# EAGLE schematic data-board (EAGLE 5.07)

## Sheet 1 of 13
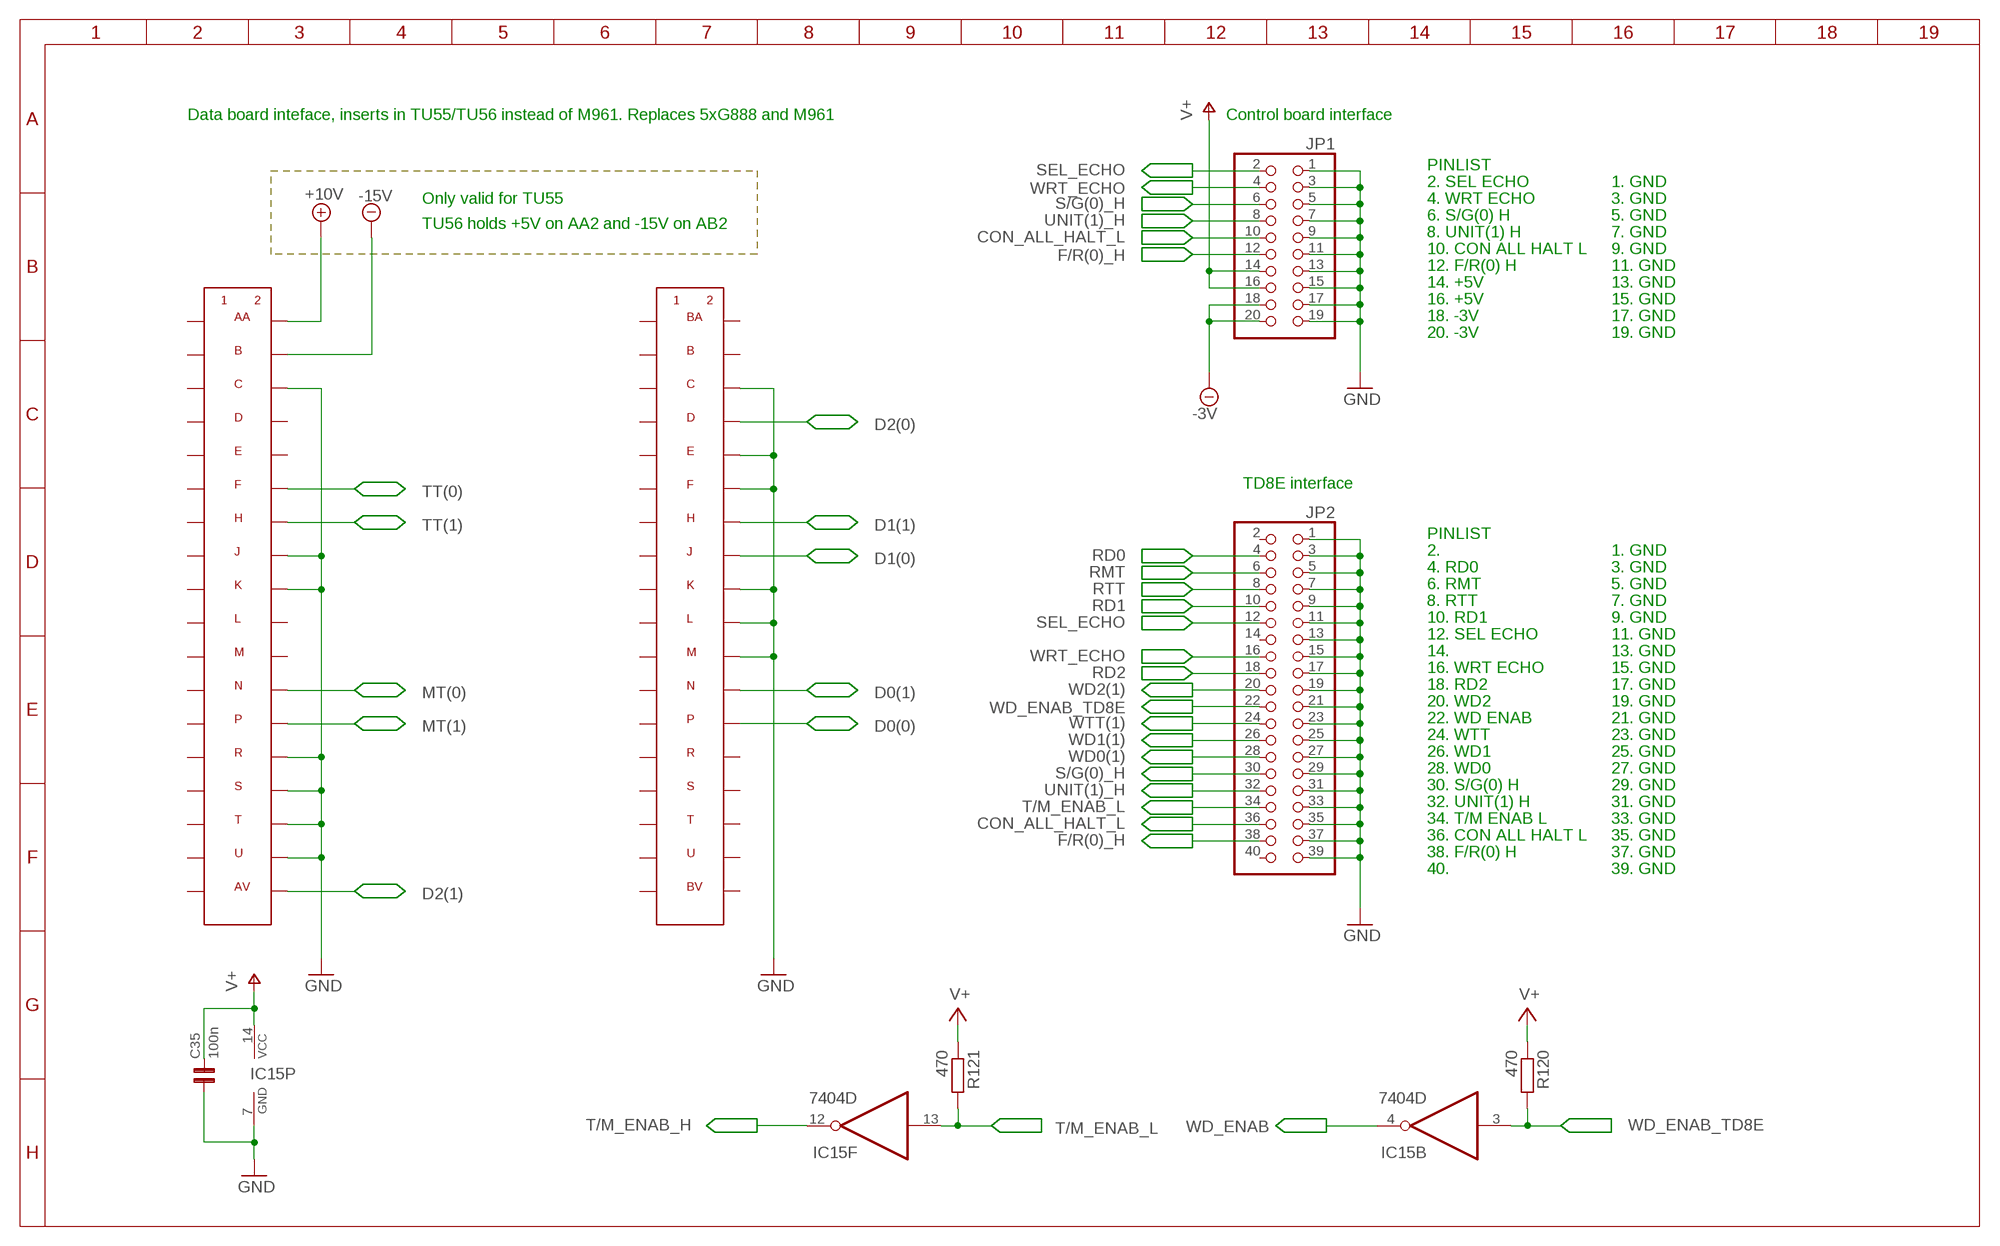
[diagram p0: schematic, sheet 1]

### Parts
C35  100n  C0805  [0805]
IC15  7404D  [SO14]
J1  FLIPCHIP_2  FLIPCHIP_2-SBS  [FLIPCHIP-21]
JP1  PINHD-2X10/90-FRAMED  [2Z10/90-FRAMED]
JP2  PINHD-2X20/90-FRAMED  [2X20/90-FRAMED]
R120  470  R-EU_R0805  [R0805]
R121  470  R-EU_R0805  [R0805]

### Nets
+10V: J1.AA2 ; also sheet 12
-3V: JP1.18 JP1.20 ; also sheet 12
-15V: J1.AB2 ; also sheet 12
CON_ALL_HALT_L: JP1.10 JP2.36
D0(0): J1.BP2 ; also sheet 4,9
D0(1): J1.BN2 ; also sheet 4,9
D1(0): J1.BJ2 ; also sheet 5,10
D1(1): J1.BH2 ; also sheet 5,10
D2(0): J1.BD2 ; also sheet 6,11
D2(1): J1.AV2 ; also sheet 6,11
F/R(0)_H: JP1.12 JP2.38
GND: C35.1 IC15.7(P:GND) J1.AC2 J1.AJ2 J1.AK2 J1.AR2 J1.AS2 J1.AT2 J1.AU2 J1.BC2 J1.BE2 J1.BF2 J1.BK2 J1.BL2 J1.BM2 JP1.1 JP1.3 JP1.5 JP1.7 JP1.9 JP1.11 JP1.13 JP1.15 JP1.17 JP1.19 JP2.1 JP2.3 JP2.5 JP2.7 JP2.9 JP2.11 JP2.13 JP2.15 JP2.17 JP2.19 JP2.21 JP2.23 JP2.25 JP2.27 JP2.29 JP2.31 JP2.33 JP2.35 JP2.37 JP2.39 ; also sheet 2,3,4,5,6,7,8,9,10,11,12
MT(0): J1.AN2 ; also sheet 3,8
MT(1): J1.AP2 ; also sheet 3,8
RD0: JP2.4 ; also sheet 4
RD1: JP2.10 ; also sheet 5
RD2: JP2.18 ; also sheet 6
RMT: JP2.6 ; also sheet 3
RTT: JP2.8 ; also sheet 2
S/G(0)_H: JP1.6 JP2.30
SEL_ECHO: JP1.2 JP2.12
T/M_ENAB_H: IC15.12(F:O) ; also sheet 7,8
T/M_ENAB_L: IC15.13(F:I) JP2.34 R121.2
TT(0): J1.AF2 ; also sheet 2,7
TT(1): J1.AH2 ; also sheet 2,7
UNIT(1)_H: JP1.8 JP2.32
V+: C35.2 IC15.14(P:VCC) JP1.14 JP1.16 R120.1 R121.1 ; also sheet 2,3,4,5,6,7,8,9,10,11,12
WD0(1): JP2.28 ; also sheet 8,9
WD1(1): JP2.26 ; also sheet 10
WD2(1): JP2.20 ; also sheet 11
WD_ENAB: IC15.4(B:O) ; also sheet 9,10,11
WD_ENAB_TD8E: IC15.3(B:I) JP2.22 R120.2
WRT_ECHO: JP1.4 JP2.16
WTT(1): JP2.24 ; also sheet 7
Unconnected: J1.AA1 J1.AB1 J1.AC1 J1.AD1 J1.AD2 J1.AE1 J1.AE2 J1.AF1 J1.AH1 J1.AJ1 J1.AK1 J1.AL1 J1.AL2 J1.AM1 J1.AM2 J1.AN1 J1.AP1 J1.AR1 J1.AS1 J1.AT1 J1.AU1 J1.AV1 J1.BA1 J1.BA2 J1.BB1 J1.BB2 J1.BC1 J1.BD1 J1.BE1 J1.BF1 J1.BH1 J1.BJ1 J1.BK1 J1.BL1 J1.BM1 J1.BN1 J1.BP1 J1.BR1 J1.BR2 J1.BS1 J1.BS2 J1.BT1 J1.BT2 J1.BU1 J1.BU2 J1.BV1 J1.BV2 JP2.2 JP2.14 JP2.40

### Notes on the sheet
- Data board inteface, inserts in TU55/TU56 instead of M961. Replaces 5xG888 and M961 | Control board interface
- PINLIST
- 2. SEL ECHO | 1. GND
- Only valid for TU55 | 4. WRT ECHO | 3. GND
- 6. S/G(0) H | 5. GND
- TU56 holds +5V on AA2 and -15V on AB2
- 8. UNIT(1) H | 7. GND
- 10. CON ALL HALT L | 9. GND
- 12. F/R(0) H | 11. GND
- 14. +5V | 13. GND
- 16. +5V | 15. GND
- 18. -3V | 17. GND
- 20. -3V | 19. GND
- TD8E interface
- PINLIST
- 2. | 1. GND
- 4. RD0 | 3. GND
- 6. RMT | 5. GND
- 8. RTT | 7. GND
- 10. RD1 | 9. GND
- 12. SEL ECHO | 11. GND
- 14. | 13. GND
- 16. WRT ECHO | 15. GND
- 18. RD2 | 17. GND
- 20. WD2 | 19. GND
- 22. WD ENAB | 21. GND
- 24. WTT | 23. GND
- 26. WD1 | 25. GND
- 28. WD0 | 27. GND
- 30. S/G(0) H | 29. GND
- 32. UNIT(1) H | 31. GND
- 34. T/M ENAB L | 33. GND
- 36. CON ALL HALT L | 35. GND
- 38. F/R(0) H | 37. GND
- 40. | 39. GND

## Sheet 2 of 13
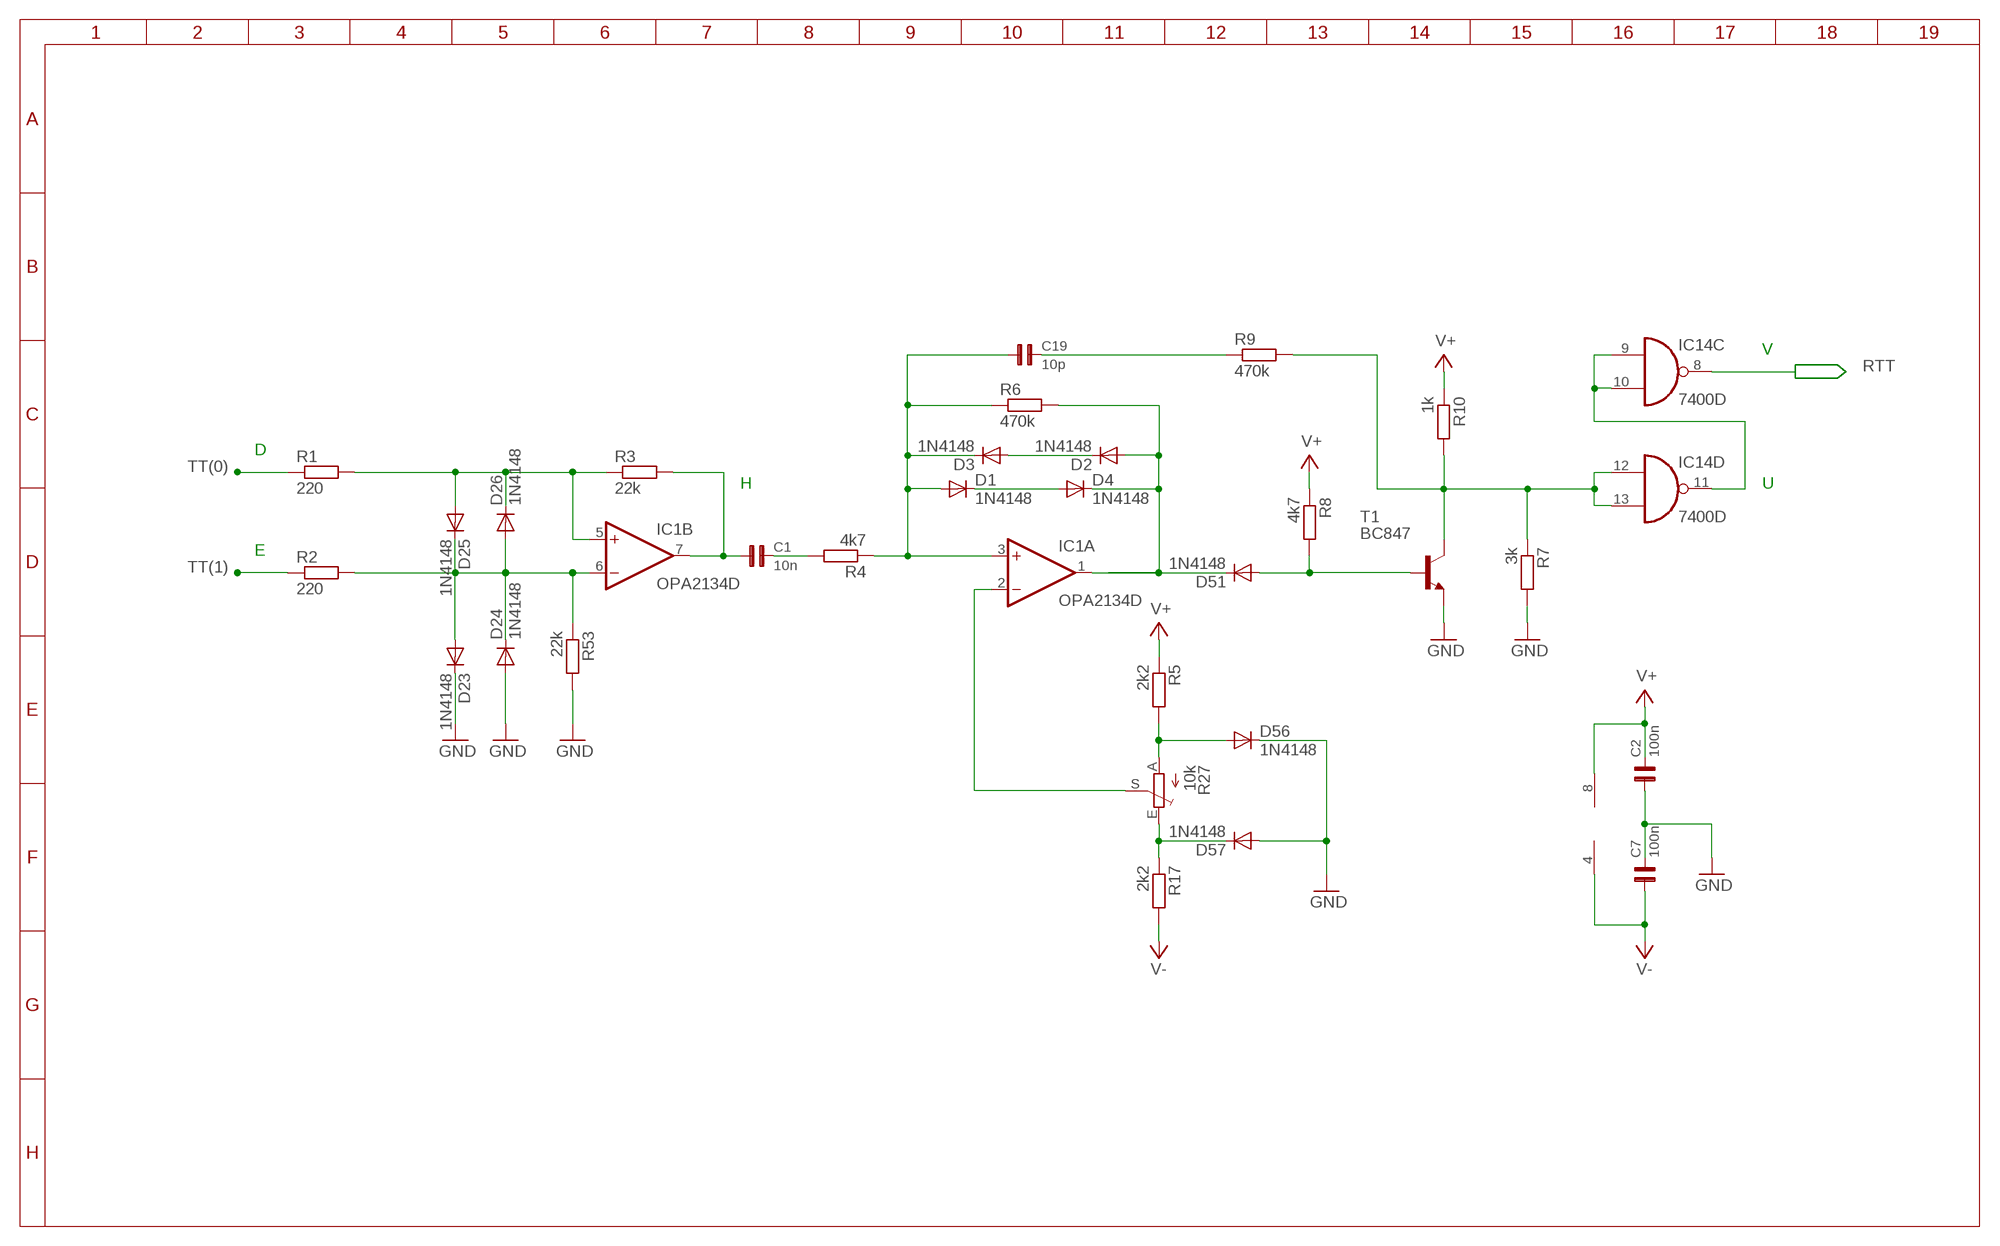
[diagram p1: schematic, sheet 2]

### Parts
C1  10n  C0805  [0805]
C2  100n  C0805  [0805]
C7  100n  C0805  [0805]
C19  10p  C0805  [0805]
D1  1N4148  1N4148-Y  [SOD123]
D2  1N4148  1N4148-Y  [SOD123]
D3  1N4148  1N4148-Y  [SOD123]
D4  1N4148  1N4148-Y  [SOD123]
D23  1N4148  1N4148-Y  [SOD123]
D24  1N4148  1N4148-Y  [SOD123]
D25  1N4148  1N4148-Y  [SOD123]
D26  1N4148  1N4148-Y  [SOD123]
D51  1N4148  1N4148-Y  [SOD123]
D56  1N4148  1N4148-Y  [SOD123]
D57  1N4148  1N4148-Y  [SOD123]
IC1  OPA2134D  [SOIC8]
IC14  7400D  [SO14]
R1  220  R-EU_R0805  [R0805]
R2  220  R-EU_R0805  [R0805]
R3  22k  R-EU_R0805  [R0805]
R4  4k7  R-EU_R0805  [R0805]
R5  2k2  R-EU_R0805  [R0805]
R6  470k  R-EU_R0805  [R0805]
R7  3k  R-EU_R0805  [R0805]
R8  4k7  R-EU_R0805  [R0805]
R9  470k  R-EU_R0805  [R0805]
R10  1k  R-EU_R0805  [R0805]
R17  2k2  R-EU_R0805  [R0805]
R27  10k  TRIM_EU-SP19L  [SP19L]
R53  22k  R-EU_R0805  [R0805]
T1  BC847  [SOT23]

### Nets
GND: C2.1 C7.2 D23.C D24.A D56.C D57.A R7.2 R53.2 T1.2(E) ; also sheet 1,3,4,5,6,7,8,9,10,11,12
N$1: D25.A D26.C IC1.5(B:+IN) R1.2 R3.1
N$3: C1.1 IC1.7(B:OUT) R3.2
N$4: D1.C D4.A
N$5: C19.1 D1.A D3.C IC1.3(A:+IN) R4.1 R6.1
N$7: D2.A D4.C D51.C IC1.1(A:OUT) R6.2
N$8: D51.A R8.2 T1.1(B)
N$9: C19.2 R9.1
N$11: D2.C D3.A
N$12: C1.2 R4.2
N$33: IC1.2(A:-IN) R27.S
N$47: D56.A R5.2 R27.A
N$73: D57.C R17.1 R27.E
N$116: IC14.9(C:I0) IC14.10(C:I1) IC14.11(D:O)
N$128: D23.A D24.C D25.C D26.A IC1.6(B:-IN) R2.2 R53.1
RTT: IC14.8(C:O) ; also sheet 1
TIMING: IC14.12(D:I0) IC14.13(D:I1) R7.1 R9.2 R10.2 T1.3(C)
TT(0): R1.1 ; also sheet 1,7
TT(1): R2.1 ; also sheet 1,7
V+: C2.2 IC1.8(P:V+) R5.1 R8.1 R10.1 ; also sheet 1,3,4,5,6,7,8,9,10,11,12
V-: C7.1 IC1.4(P:V-) R17.2 ; also sheet 3,4,5,6,12

### Notes on the sheet
- V
- D
- H | U
- E

## Sheet 3 of 13
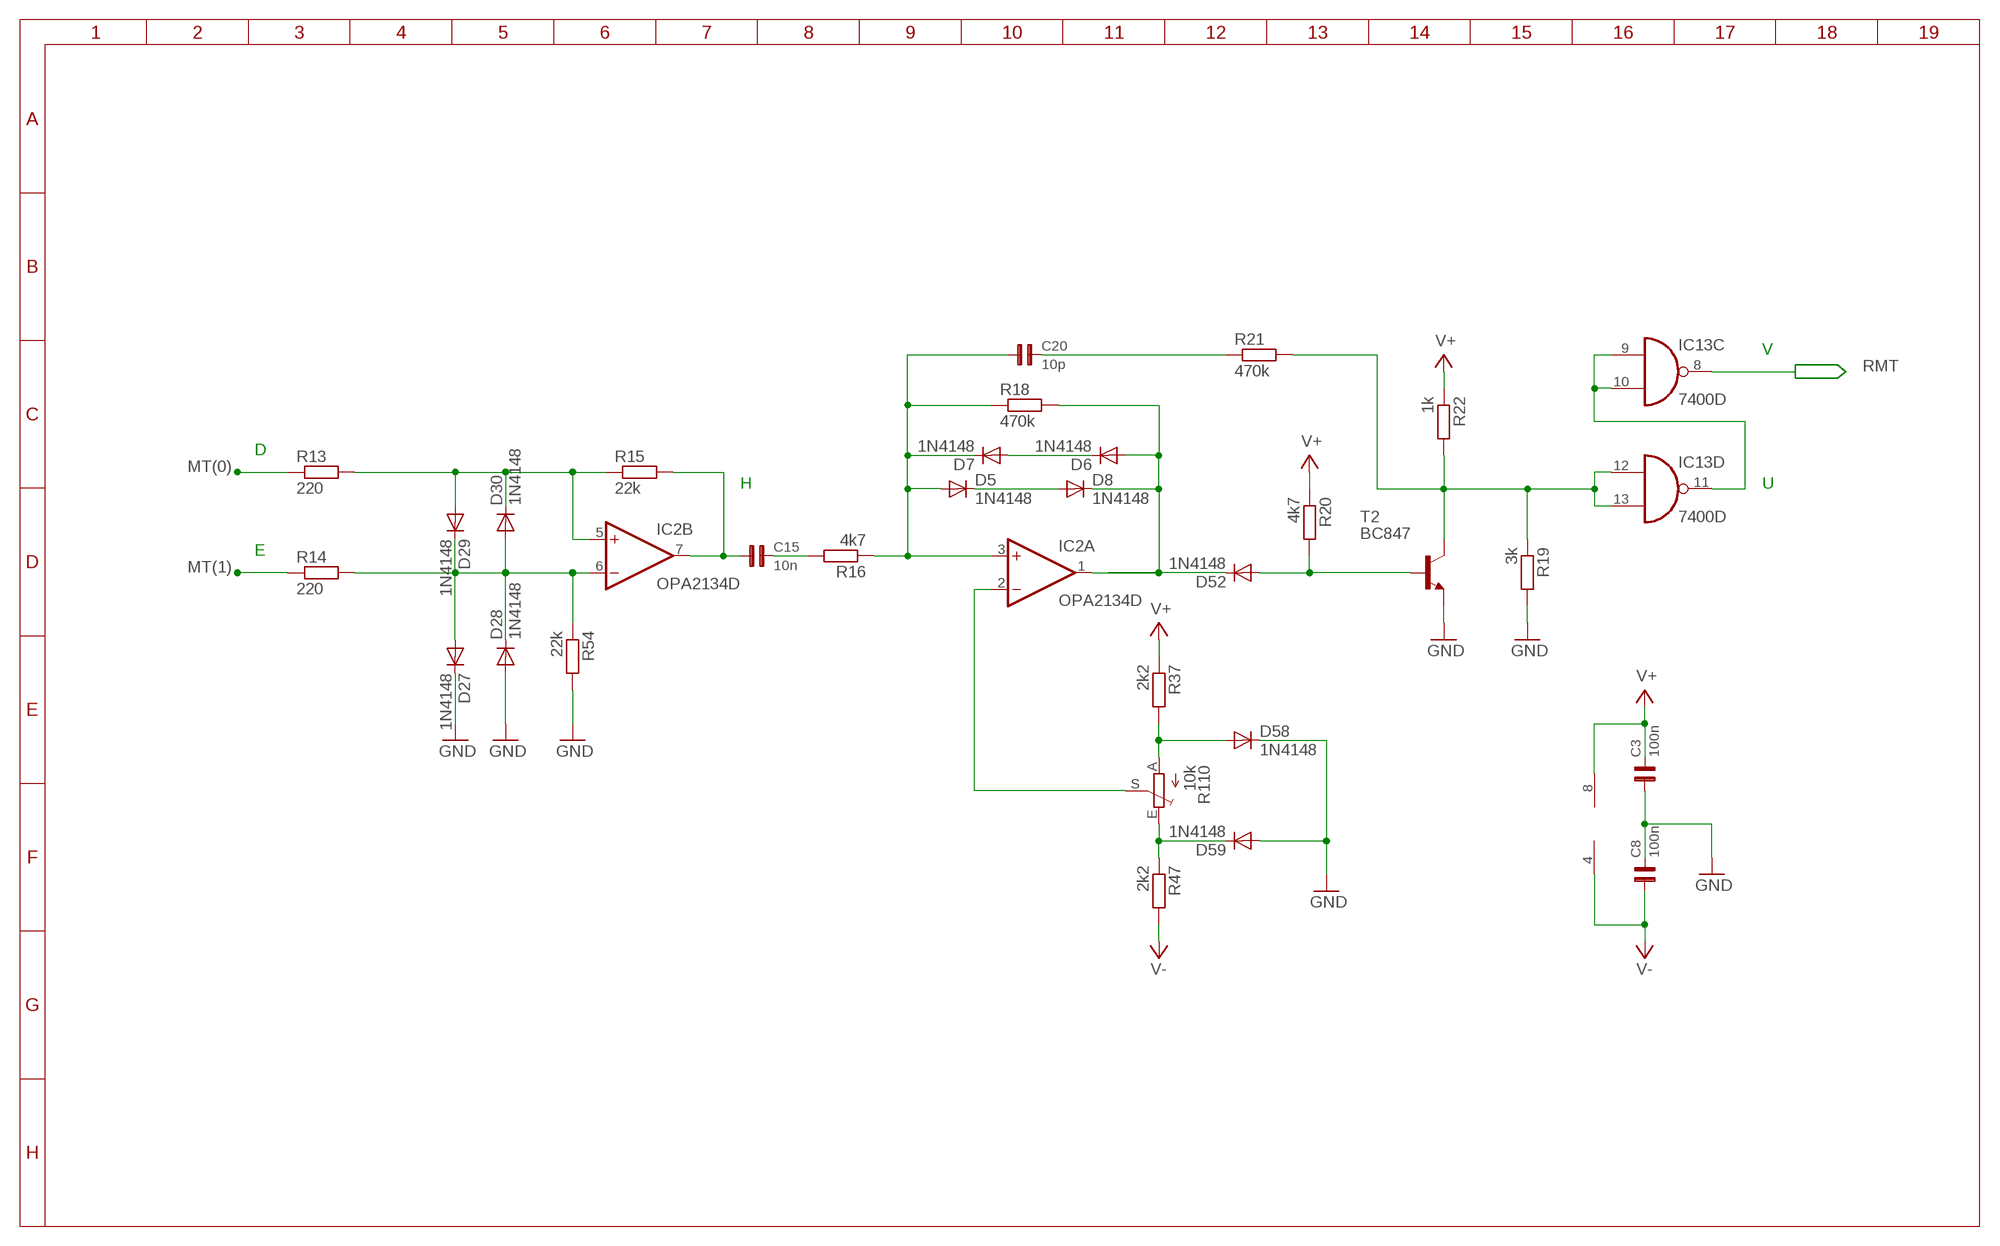
[diagram p2: schematic, sheet 3]

### Parts
C3  100n  C0805  [0805]
C8  100n  C0805  [0805]
C15  10n  C0805  [0805]
C20  10p  C0805  [0805]
D5  1N4148  1N4148-Y  [SOD123]
D6  1N4148  1N4148-Y  [SOD123]
D7  1N4148  1N4148-Y  [SOD123]
D8  1N4148  1N4148-Y  [SOD123]
D27  1N4148  1N4148-Y  [SOD123]
D28  1N4148  1N4148-Y  [SOD123]
D29  1N4148  1N4148-Y  [SOD123]
D30  1N4148  1N4148-Y  [SOD123]
D52  1N4148  1N4148-Y  [SOD123]
D58  1N4148  1N4148-Y  [SOD123]
D59  1N4148  1N4148-Y  [SOD123]
IC2  OPA2134D  [SOIC8]
IC13  7400D  [SO14]
R13  220  R-EU_R0805  [R0805]
R14  220  R-EU_R0805  [R0805]
R15  22k  R-EU_R0805  [R0805]
R16  4k7  R-EU_R0805  [R0805]
R18  470k  R-EU_R0805  [R0805]
R19  3k  R-EU_R0805  [R0805]
R20  4k7  R-EU_R0805  [R0805]
R21  470k  R-EU_R0805  [R0805]
R22  1k  R-EU_R0805  [R0805]
R37  2k2  R-EU_R0805  [R0805]
R47  2k2  R-EU_R0805  [R0805]
R54  22k  R-EU_R0805  [R0805]
R110  10k  TRIM_EU-SP19L  [SP19L]
T2  BC847  [SOT23]

### Nets
GND: C3.1 C8.2 D27.C D28.A D58.C D59.A R19.2 R54.2 T2.2(E) ; also sheet 1,2,4,5,6,7,8,9,10,11,12
MARK: IC13.12(D:I0) IC13.13(D:I1) R19.1 R21.2 R22.2 T2.3(C)
MT(0): R13.1 ; also sheet 1,8
MT(1): R14.1 ; also sheet 1,8
N$27: C15.1 IC2.7(B:OUT) R15.2
N$28: D5.C D8.A
N$29: C20.1 D5.A D7.C IC2.3(A:+IN) R16.1 R18.1
N$30: D6.A D8.C D52.C IC2.1(A:OUT) R18.2
N$32: D52.A R20.2 T2.1(B)
N$35: C15.2 R16.2
N$38: D6.C D7.A
N$76: IC13.9(C:I0) IC13.10(C:I1) IC13.11(D:O)
N$84: C20.2 R21.1
N$85: IC2.2(A:-IN) R110.S
N$86: D58.A R37.2 R110.A
N$87: D59.C R47.1 R110.E
N$129: D29.A D30.C IC2.5(B:+IN) R13.2 R15.1
N$130: D27.A D28.C D29.C D30.A IC2.6(B:-IN) R14.2 R54.1
RMT: IC13.8(C:O) ; also sheet 1
V+: C3.2 IC2.8(P:V+) R20.1 R22.1 R37.1 ; also sheet 1,2,4,5,6,7,8,9,10,11,12
V-: C8.1 IC2.4(P:V-) R47.2 ; also sheet 2,4,5,6,12

### Notes on the sheet
- V
- D
- H | U
- E

## Sheet 4 of 13
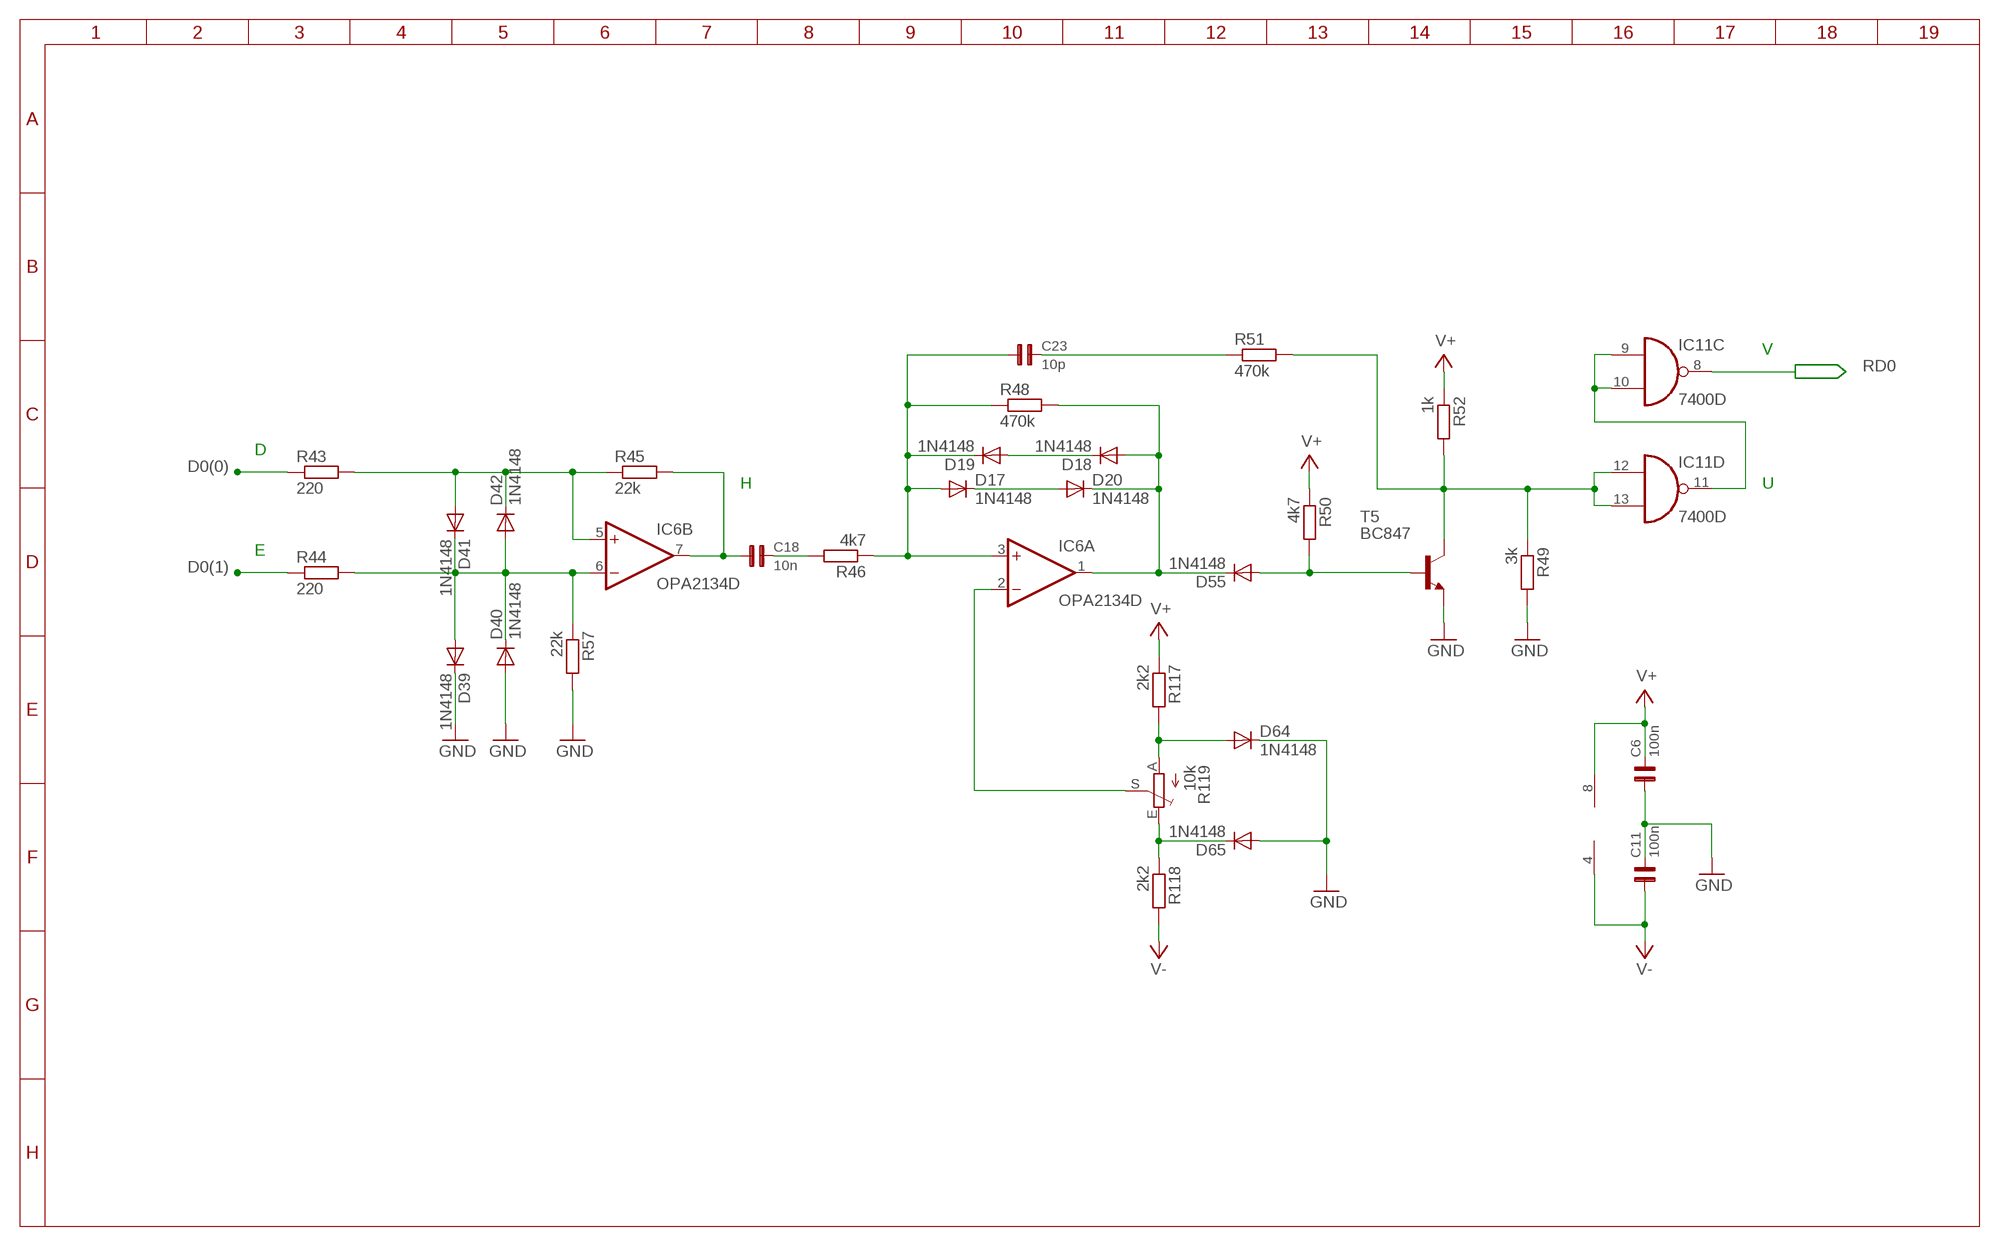
[diagram p3: schematic, sheet 4]

### Parts
C6  100n  C0805  [0805]
C11  100n  C0805  [0805]
C18  10n  C0805  [0805]
C23  10p  C0805  [0805]
D17  1N4148  1N4148-Y  [SOD123]
D18  1N4148  1N4148-Y  [SOD123]
D19  1N4148  1N4148-Y  [SOD123]
D20  1N4148  1N4148-Y  [SOD123]
D39  1N4148  1N4148-Y  [SOD123]
D40  1N4148  1N4148-Y  [SOD123]
D41  1N4148  1N4148-Y  [SOD123]
D42  1N4148  1N4148-Y  [SOD123]
D55  1N4148  1N4148-Y  [SOD123]
D64  1N4148  1N4148-Y  [SOD123]
D65  1N4148  1N4148-Y  [SOD123]
IC6  OPA2134D  [SOIC8]
IC11  7400D  [SO14]
R43  220  R-EU_R0805  [R0805]
R44  220  R-EU_R0805  [R0805]
R45  22k  R-EU_R0805  [R0805]
R46  4k7  R-EU_R0805  [R0805]
R48  470k  R-EU_R0805  [R0805]
R49  3k  R-EU_R0805  [R0805]
R50  4k7  R-EU_R0805  [R0805]
R51  470k  R-EU_R0805  [R0805]
R52  1k  R-EU_R0805  [R0805]
R57  22k  R-EU_R0805  [R0805]
R117  2k2  R-EU_R0805  [R0805]
R118  2k2  R-EU_R0805  [R0805]
R119  10k  TRIM_EU-SP19L  [SP19L]
T5  BC847  [SOT23]

### Nets
D0(0): R43.1 ; also sheet 1,9
D0(1): R44.1 ; also sheet 1,9
DATA1: IC11.12(D:I0) IC11.13(D:I1) R49.1 R51.2 R52.2 T5.3(C)
GND: C6.1 C11.2 D39.C D40.A D64.C D65.A R49.2 R57.2 T5.2(E) ; also sheet 1,2,3,5,6,7,8,9,10,11,12
N$10: C23.2 R51.1
N$49: IC11.9(C:I0) IC11.10(C:I1) IC11.11(D:O)
N$66: C18.1 IC6.7(B:OUT) R45.2
N$67: D17.C D20.A
N$68: C23.1 D17.A D19.C IC6.3(A:+IN) R46.1 R48.1
N$69: D18.A D20.C D55.C IC6.1(A:OUT) R48.2
N$71: D55.A R50.2 T5.1(B)
N$74: C18.2 R46.2
N$77: D18.C D19.A
N$92: D64.A R117.2 R119.A
N$93: D65.C R118.1 R119.E
N$115: IC6.2(A:-IN) R119.S
N$141: D41.A D42.C IC6.5(B:+IN) R43.2 R45.1
N$142: D39.A D40.C D41.C D42.A IC6.6(B:-IN) R44.2 R57.1
RD0: IC11.8(C:O) ; also sheet 1
V+: C6.2 IC6.8(P:V+) R50.1 R52.1 R117.1 ; also sheet 1,2,3,5,6,7,8,9,10,11,12
V-: C11.1 IC6.4(P:V-) R118.2 ; also sheet 2,3,5,6,12

### Notes on the sheet
- V
- D
- H | U
- E

## Sheet 5 of 13
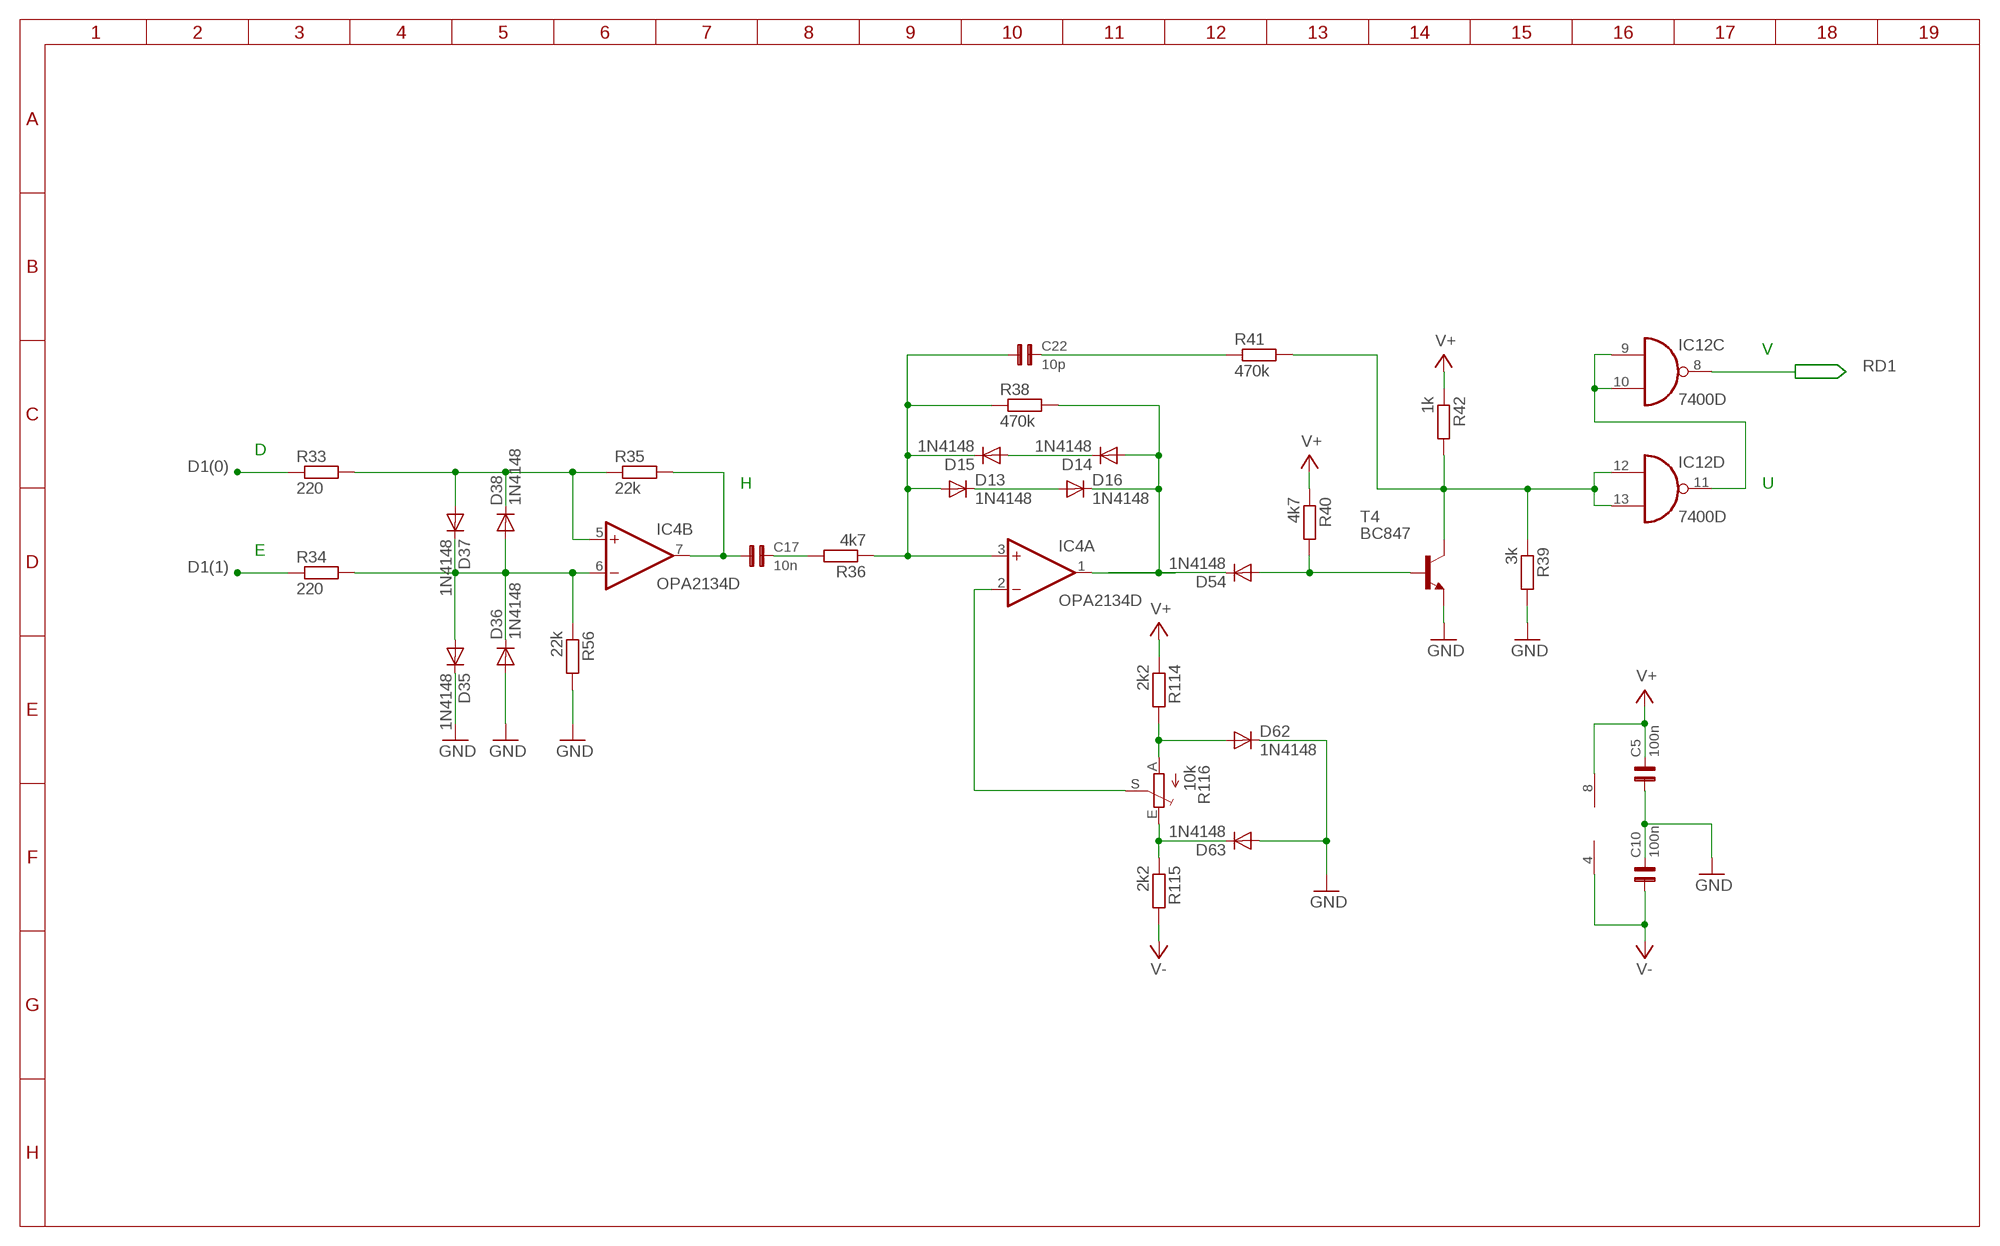
[diagram p4: schematic, sheet 5]

### Parts
C5  100n  C0805  [0805]
C10  100n  C0805  [0805]
C17  10n  C0805  [0805]
C22  10p  C0805  [0805]
D13  1N4148  1N4148-Y  [SOD123]
D14  1N4148  1N4148-Y  [SOD123]
D15  1N4148  1N4148-Y  [SOD123]
D16  1N4148  1N4148-Y  [SOD123]
D35  1N4148  1N4148-Y  [SOD123]
D36  1N4148  1N4148-Y  [SOD123]
D37  1N4148  1N4148-Y  [SOD123]
D38  1N4148  1N4148-Y  [SOD123]
D54  1N4148  1N4148-Y  [SOD123]
D62  1N4148  1N4148-Y  [SOD123]
D63  1N4148  1N4148-Y  [SOD123]
IC4  OPA2134D  [SOIC8]
IC12  7400D  [SO14]
R33  220  R-EU_R0805  [R0805]
R34  220  R-EU_R0805  [R0805]
R35  22k  R-EU_R0805  [R0805]
R36  4k7  R-EU_R0805  [R0805]
R38  470k  R-EU_R0805  [R0805]
R39  3k  R-EU_R0805  [R0805]
R40  4k7  R-EU_R0805  [R0805]
R41  470k  R-EU_R0805  [R0805]
R42  1k  R-EU_R0805  [R0805]
R56  22k  R-EU_R0805  [R0805]
R114  2k2  R-EU_R0805  [R0805]
R115  2k2  R-EU_R0805  [R0805]
R116  10k  TRIM_EU-SP19L  [SP19L]
T4  BC847  [SOT23]

### Nets
D1(0): R33.1 ; also sheet 1,10
D1(1): R34.1 ; also sheet 1,10
DATA2: IC12.12(D:I0) IC12.13(D:I1) R39.1 R41.2 R42.2 T4.3(C)
GND: C5.1 C10.2 D35.C D36.A D62.C D63.A R39.2 R56.2 T4.2(E) ; also sheet 1,2,3,4,6,7,8,9,10,11,12
N$34: C22.2 R41.1
N$53: C17.1 IC4.7(B:OUT) R35.2
N$54: D13.C D16.A
N$55: C22.1 D13.A D15.C IC4.3(A:+IN) R36.1 R38.1
N$56: D14.A D16.C D54.C IC4.1(A:OUT) R38.2
N$58: D54.A R40.2 T4.1(B)
N$61: C17.2 R36.2
N$64: D14.C D15.A
N$79: IC12.9(C:I0) IC12.10(C:I1) IC12.11(D:O)
N$90: D62.A R114.2 R116.A
N$91: D63.C R115.1 R116.E
N$98: IC4.2(A:-IN) R116.S
N$137: D37.A D38.C IC4.5(B:+IN) R33.2 R35.1
N$138: D35.A D36.C D37.C D38.A IC4.6(B:-IN) R34.2 R56.1
RD1: IC12.8(C:O) ; also sheet 1
V+: C5.2 IC4.8(P:V+) R40.1 R42.1 R114.1 ; also sheet 1,2,3,4,6,7,8,9,10,11,12
V-: C10.1 IC4.4(P:V-) R115.2 ; also sheet 2,3,4,6,12

### Notes on the sheet
- V
- D
- H | U
- E

## Sheet 6 of 13
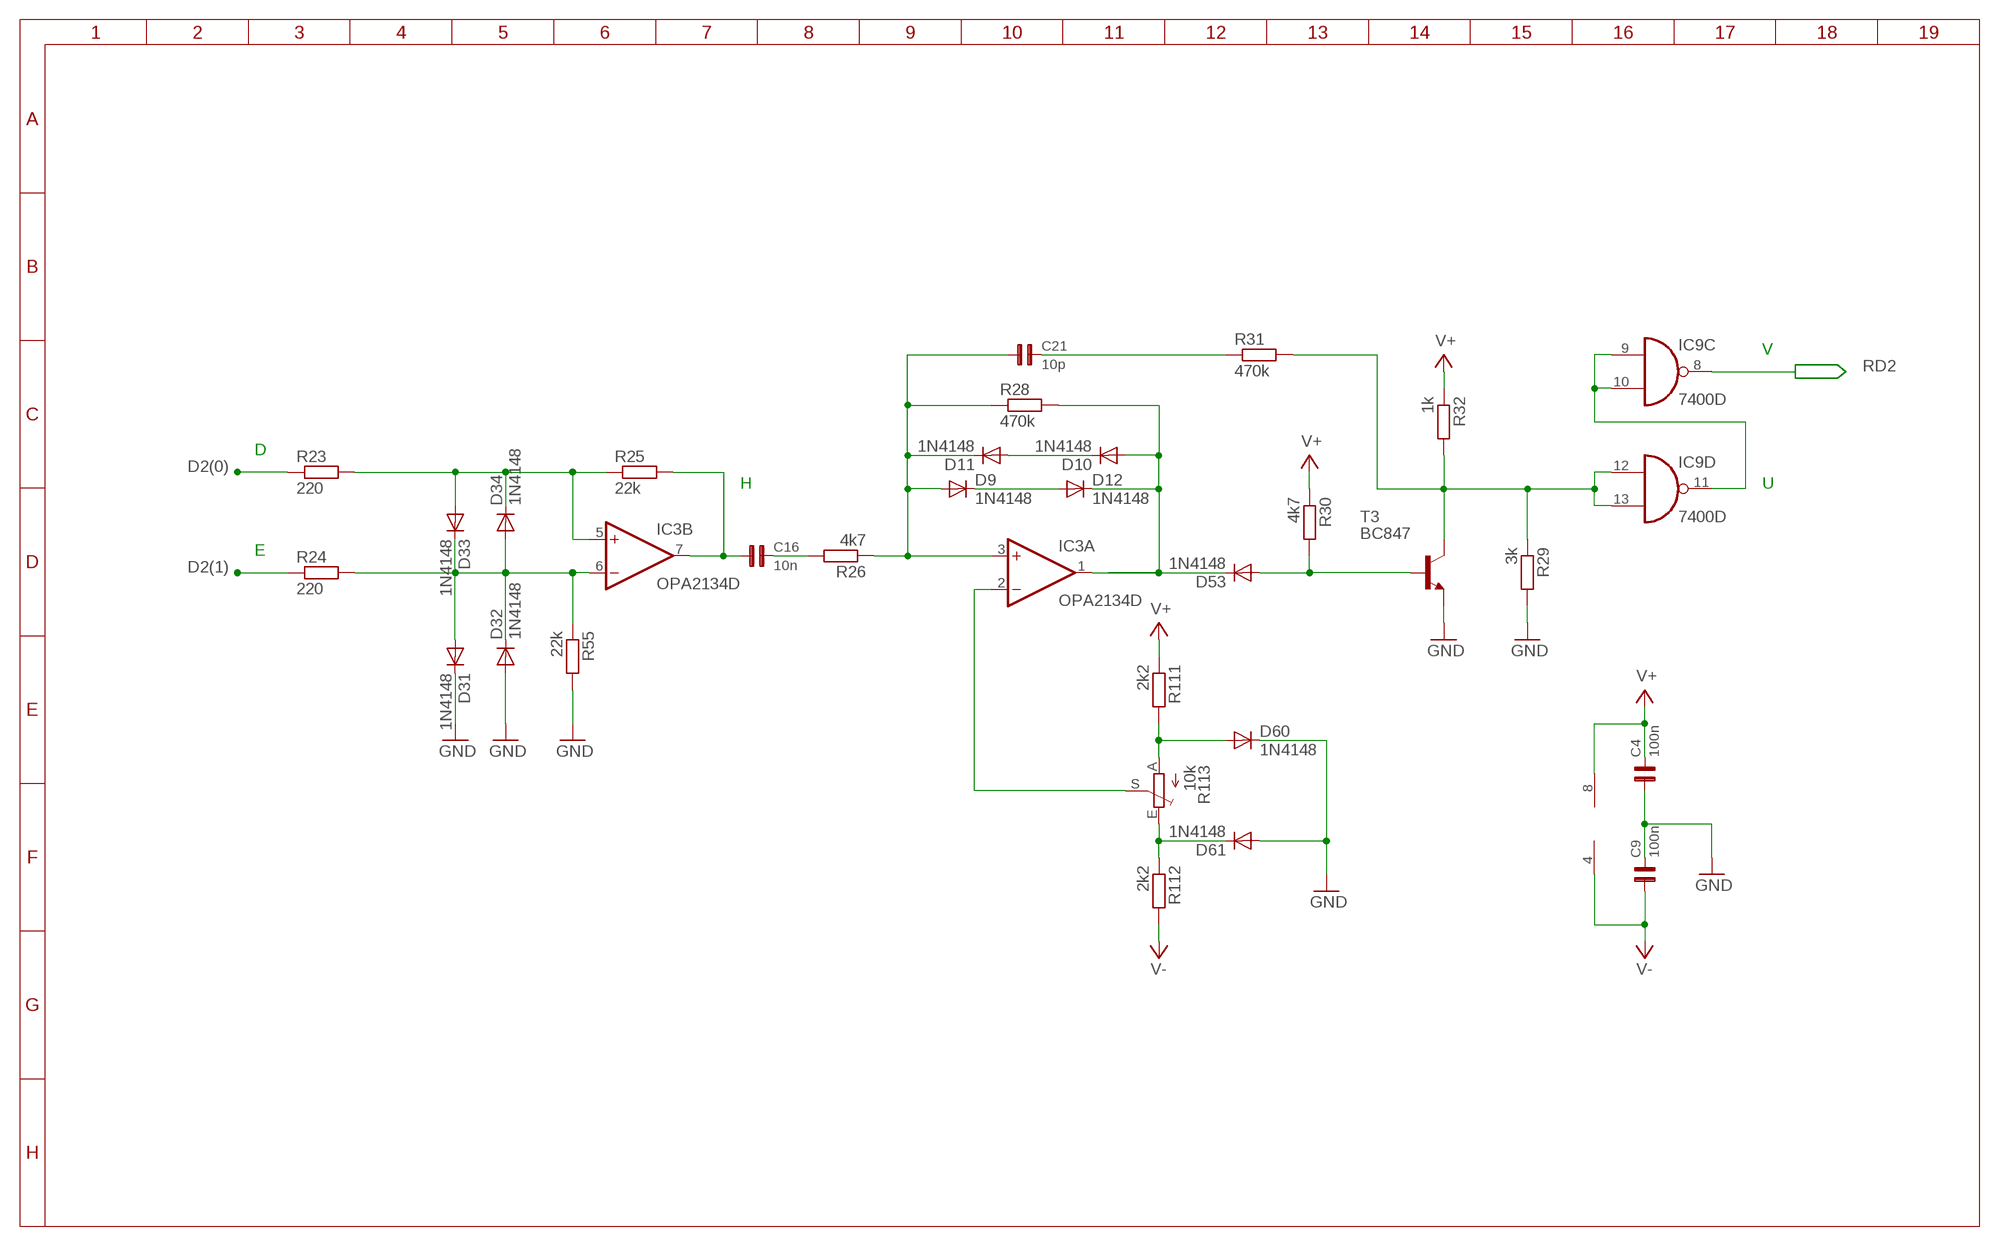
[diagram p5: schematic, sheet 6]

### Parts
C4  100n  C0805  [0805]
C9  100n  C0805  [0805]
C16  10n  C0805  [0805]
C21  10p  C0805  [0805]
D9  1N4148  1N4148-Y  [SOD123]
D10  1N4148  1N4148-Y  [SOD123]
D11  1N4148  1N4148-Y  [SOD123]
D12  1N4148  1N4148-Y  [SOD123]
D31  1N4148  1N4148-Y  [SOD123]
D32  1N4148  1N4148-Y  [SOD123]
D33  1N4148  1N4148-Y  [SOD123]
D34  1N4148  1N4148-Y  [SOD123]
D53  1N4148  1N4148-Y  [SOD123]
D60  1N4148  1N4148-Y  [SOD123]
D61  1N4148  1N4148-Y  [SOD123]
IC3  OPA2134D  [SOIC8]
IC9  7400D  [SO14]
R23  220  R-EU_R0805  [R0805]
R24  220  R-EU_R0805  [R0805]
R25  22k  R-EU_R0805  [R0805]
R26  4k7  R-EU_R0805  [R0805]
R28  470k  R-EU_R0805  [R0805]
R29  3k  R-EU_R0805  [R0805]
R30  4k7  R-EU_R0805  [R0805]
R31  470k  R-EU_R0805  [R0805]
R32  1k  R-EU_R0805  [R0805]
R55  22k  R-EU_R0805  [R0805]
R111  2k2  R-EU_R0805  [R0805]
R112  2k2  R-EU_R0805  [R0805]
R113  10k  TRIM_EU-SP19L  [SP19L]
T3  BC847  [SOT23]

### Nets
D2(0): R23.1 ; also sheet 1,11
D2(1): R24.1 ; also sheet 1,11
DATA3: IC9.12(D:I0) IC9.13(D:I1) R29.1 R31.2 R32.2 T3.3(C)
GND: C4.1 C9.2 D31.C D32.A D60.C D61.A R29.2 R55.2 T3.2(E) ; also sheet 1,2,3,4,5,7,8,9,10,11,12
N$40: C16.1 IC3.7(B:OUT) R25.2
N$41: D9.C D12.A
N$42: C21.1 D9.A D11.C IC3.3(A:+IN) R26.1 R28.1
N$43: D10.A D12.C D53.C IC3.1(A:OUT) R28.2
N$45: D53.A R30.2 T3.1(B)
N$48: C16.2 R26.2
N$50: IC9.9(C:I0) IC9.10(C:I1) IC9.11(D:O)
N$51: D10.C D11.A
N$60: C21.2 R31.1
N$88: D60.A R111.2 R113.A
N$89: D61.C R112.1 R113.E
N$106: IC3.2(A:-IN) R113.S
N$133: D33.A D34.C IC3.5(B:+IN) R23.2 R25.1
N$134: D31.A D32.C D33.C D34.A IC3.6(B:-IN) R24.2 R55.1
RD2: IC9.8(C:O) ; also sheet 1
V+: C4.2 IC3.8(P:V+) R30.1 R32.1 R111.1 ; also sheet 1,2,3,4,5,7,8,9,10,11,12
V-: C9.1 IC3.4(P:V-) R112.2 ; also sheet 2,3,4,5,12

### Notes on the sheet
- V
- D
- H | U
- E

## Sheet 7 of 13
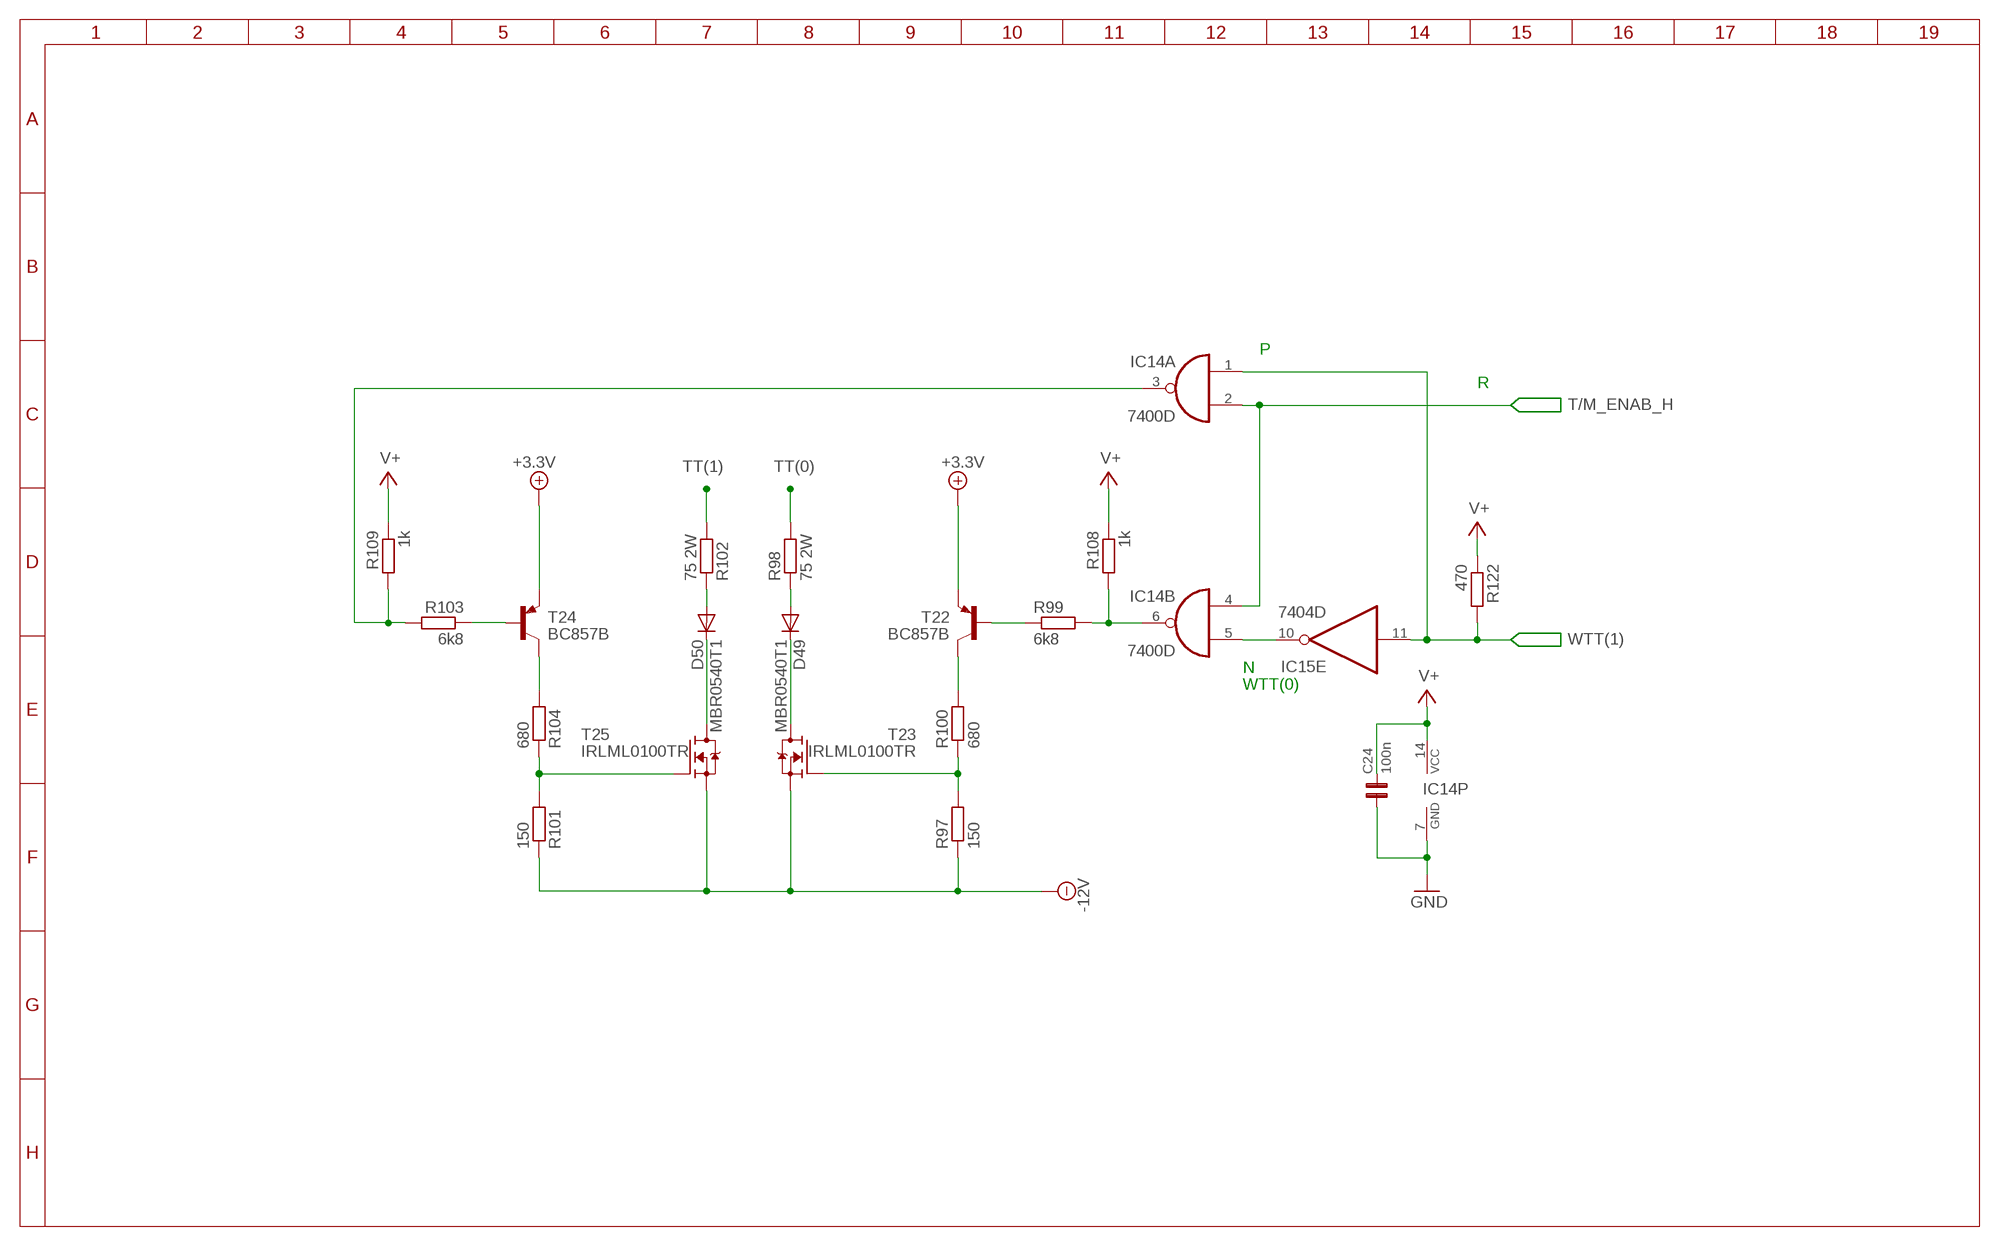
[diagram p6: schematic, sheet 7]

### Parts
C24  100n  C0805  [0805]
D49  MBR0540T1  [SOD123]
D50  MBR0540T1  [SOD123]
R97  150  R-EU_R0805  [R0805]
R98  75 2W  R-EU_R2512  [R2512]
R99  6k8  R-EU_R0805  [R0805]
R100  680  R-EU_R0805  [R0805]
R101  150  R-EU_R0805  [R0805]
R102  75 2W  R-EU_R2512  [R2512]
R103  6k8  R-EU_R0805  [R0805]
R104  680  R-EU_R0805  [R0805]
R108  1k  R-EU_R0805  [R0805]
R109  1k  R-EU_R0805  [R0805]
R122  470  R-EU_R0805  [R0805]
T22  BC857B  [SOT23]
T23  IRLML0100TR  [SOT23]
T24  BC857B  [SOT23]
T25  IRLML0100TR  [SOT23]

### Nets
+3.3V: T22.2(E) T24.2(E) ; also sheet 8,9,10,11,12
-12V: R97.1 R101.1 T23.2(S) T25.2(S) ; also sheet 8,9,10,11,12
GND: C24.1 IC14.7(P:GND) ; also sheet 1,2,3,4,5,6,8,9,10,11,12
N$62: IC14.5(B:I1) IC15.10(E:O)
N$81: IC14.6(B:O) R99.2 R108.2
N$83: IC14.3(A:O) R103.2 R109.2
N$131: R99.1 T22.1(B)
N$132: D49.A R98.1
N$135: D49.C T23.3(D)
N$136: R100.2 T22.3(C)
N$139: R97.2 R100.1 T23.1(G)
N$140: R103.1 T24.1(B)
N$143: D50.A R102.1
N$144: D50.C T25.3(D)
N$145: R104.2 T24.3(C)
N$146: R101.2 R104.1 T25.1(G)
T/M_ENAB_H: IC14.2(A:I1) IC14.4(B:I0) ; also sheet 1,8
TT(0): R98.2 ; also sheet 1,2
TT(1): R102.2 ; also sheet 1,2
V+: C24.2 IC14.14(P:VCC) R108.1 R109.1 R122.1 ; also sheet 1,2,3,4,5,6,8,9,10,11,12
WTT(1): IC14.1(A:I0) IC15.11(E:I) R122.2 ; also sheet 1

### Notes on the sheet
- P
- R
- N
- WTT(0)

## Sheet 8 of 13
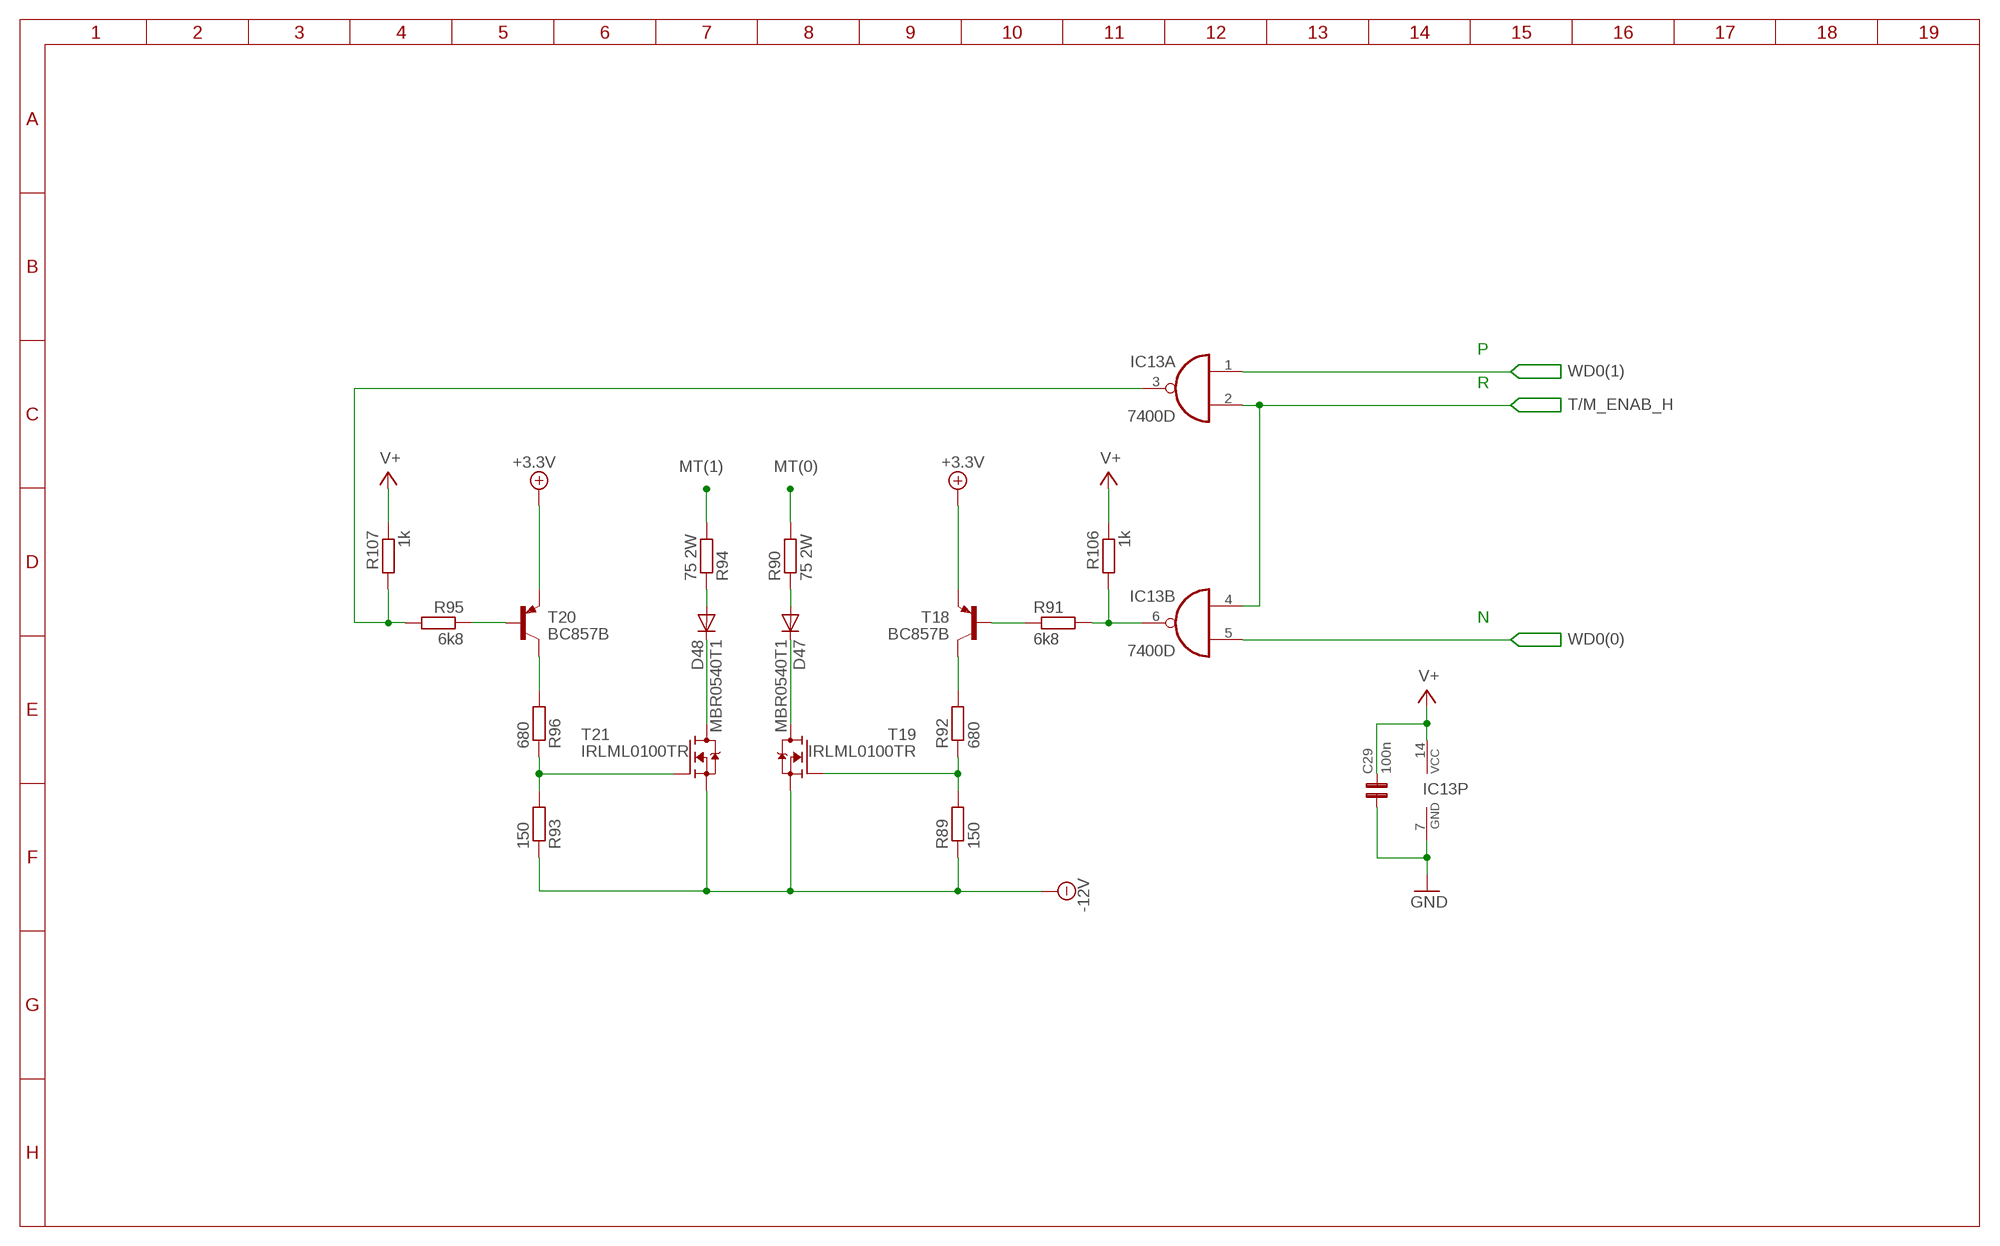
[diagram p7: schematic, sheet 8]

### Parts
C29  100n  C0805  [0805]
D47  MBR0540T1  [SOD123]
D48  MBR0540T1  [SOD123]
R89  150  R-EU_R0805  [R0805]
R90  75 2W  R-EU_R2512  [R2512]
R91  6k8  R-EU_R0805  [R0805]
R92  680  R-EU_R0805  [R0805]
R93  150  R-EU_R0805  [R0805]
R94  75 2W  R-EU_R2512  [R2512]
R95  6k8  R-EU_R0805  [R0805]
R96  680  R-EU_R0805  [R0805]
R106  1k  R-EU_R0805  [R0805]
R107  1k  R-EU_R0805  [R0805]
T18  BC857B  [SOT23]
T19  IRLML0100TR  [SOT23]
T20  BC857B  [SOT23]
T21  IRLML0100TR  [SOT23]

### Nets
+3.3V: T18.2(E) T20.2(E) ; also sheet 7,9,10,11,12
-12V: R89.1 R93.1 T19.2(S) T21.2(S) ; also sheet 7,9,10,11,12
GND: C29.1 IC13.7(P:GND) ; also sheet 1,2,3,4,5,6,7,9,10,11,12
MT(0): R90.2 ; also sheet 1,3
MT(1): R94.2 ; also sheet 1,3
N$78: IC13.6(B:O) R91.2 R106.2
N$80: IC13.3(A:O) R95.2 R107.2
N$104: R91.1 T18.1(B)
N$105: D47.A R90.1
N$107: D47.C T19.3(D)
N$108: R92.2 T18.3(C)
N$109: R89.2 R92.1 T19.1(G)
N$110: R95.1 T20.1(B)
N$111: D48.A R94.1
N$112: D48.C T21.3(D)
N$113: R96.2 T20.3(C)
N$114: R93.2 R96.1 T21.1(G)
T/M_ENAB_H: IC13.2(A:I1) IC13.4(B:I0) ; also sheet 1,7
V+: C29.2 IC13.14(P:VCC) R106.1 R107.1 ; also sheet 1,2,3,4,5,6,7,9,10,11,12
WD0(0): IC13.5(B:I1) ; also sheet 9
WD0(1): IC13.1(A:I0) ; also sheet 1,9

### Notes on the sheet
- P
- R
- N

## Sheet 9 of 13
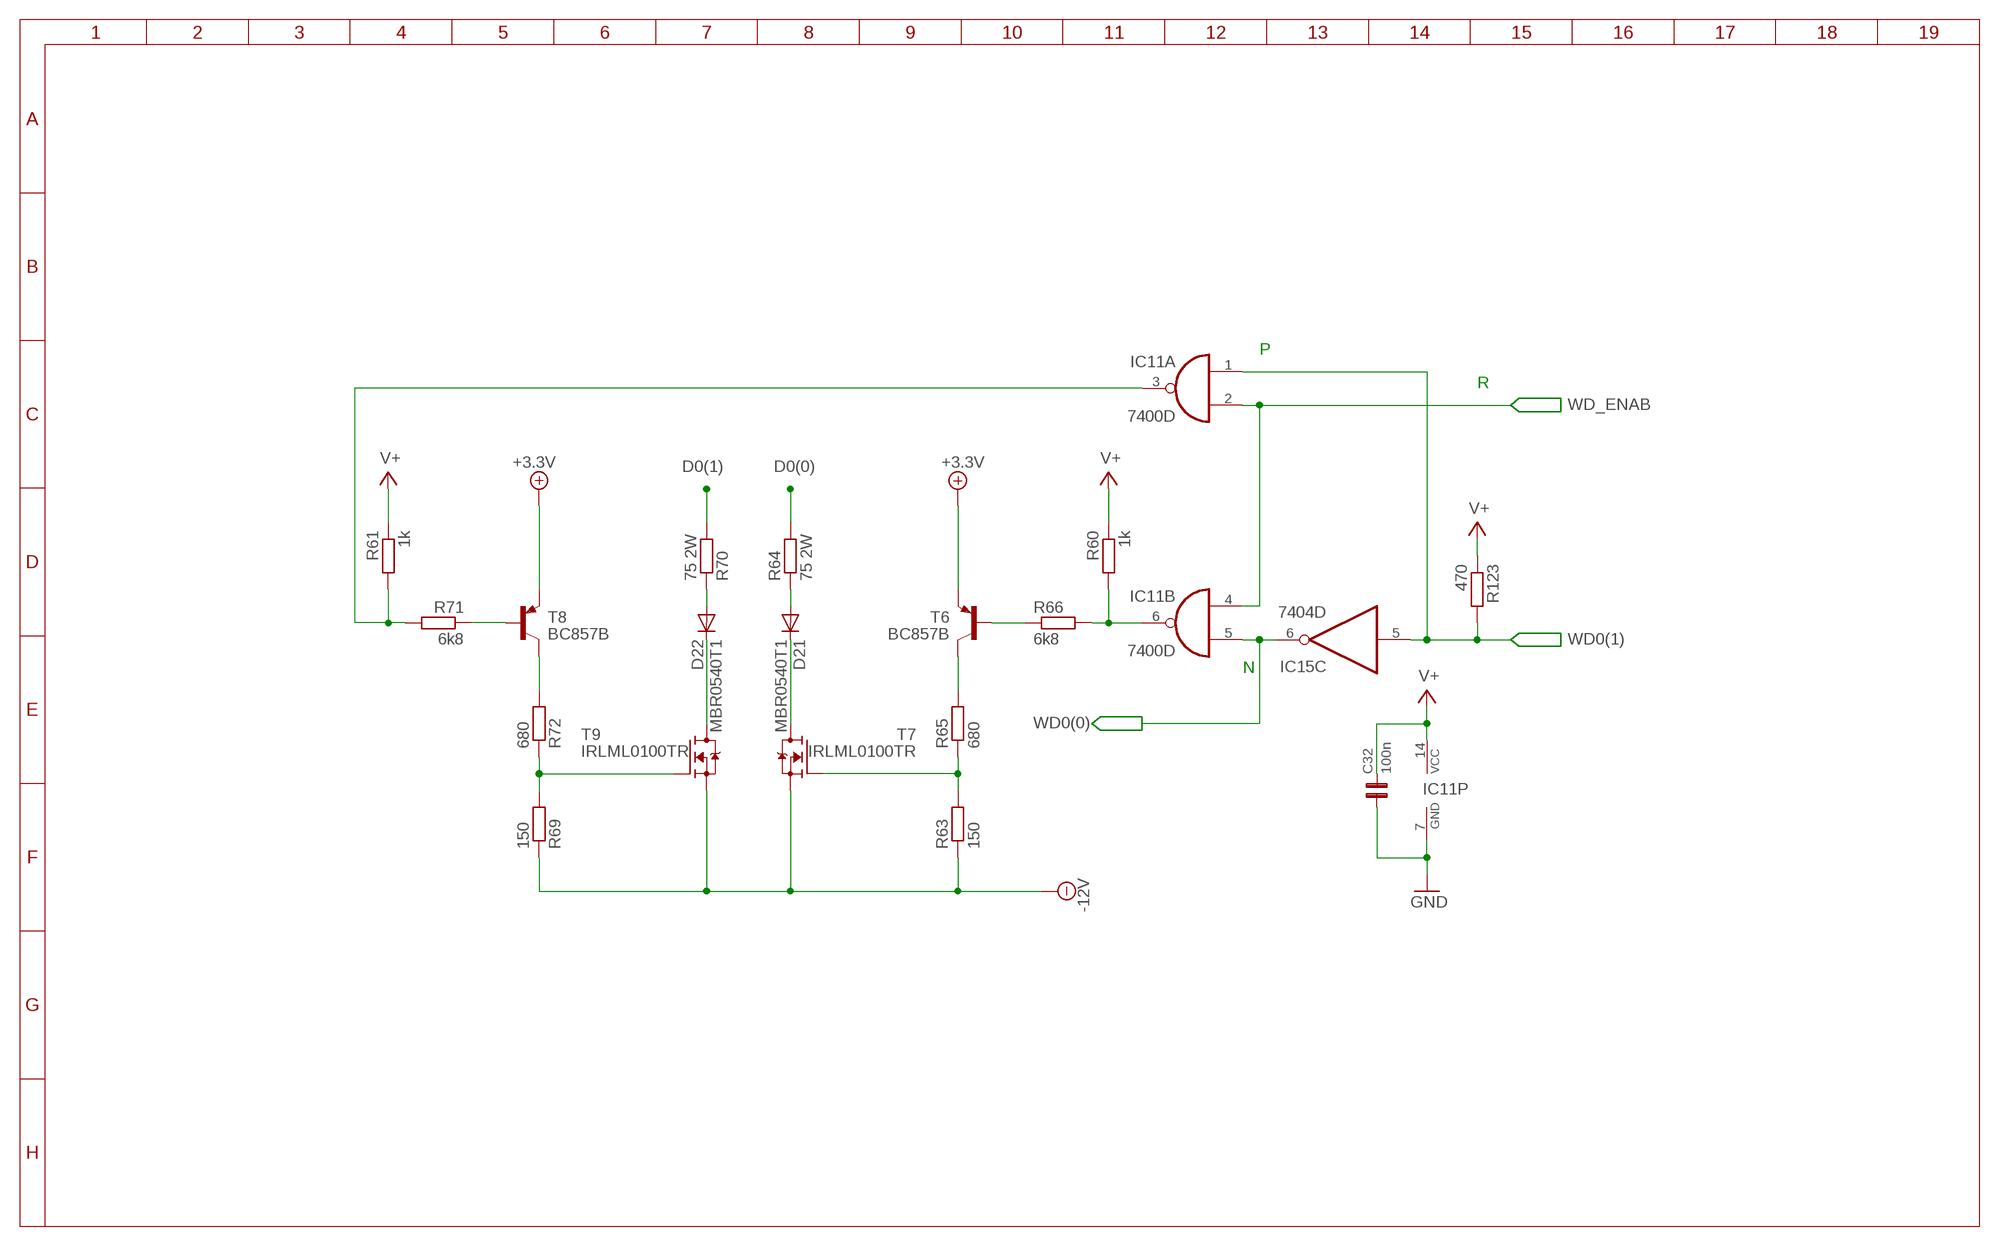
[diagram p8: schematic, sheet 9]

### Parts
C32  100n  C0805  [0805]
D21  MBR0540T1  [SOD123]
D22  MBR0540T1  [SOD123]
R60  1k  R-EU_R0805  [R0805]
R61  1k  R-EU_R0805  [R0805]
R63  150  R-EU_R0805  [R0805]
R64  75 2W  R-EU_R2512  [R2512]
R65  680  R-EU_R0805  [R0805]
R66  6k8  R-EU_R0805  [R0805]
R69  150  R-EU_R0805  [R0805]
R70  75 2W  R-EU_R2512  [R2512]
R71  6k8  R-EU_R0805  [R0805]
R72  680  R-EU_R0805  [R0805]
R123  470  R-EU_R0805  [R0805]
T6  BC857B  [SOT23]
T7  IRLML0100TR  [SOT23]
T8  BC857B  [SOT23]
T9  IRLML0100TR  [SOT23]

### Nets
+3.3V: T6.2(E) T8.2(E) ; also sheet 7,8,10,11,12
-12V: R63.1 R69.1 T7.2(S) T9.2(S) ; also sheet 7,8,10,11,12
D0(0): R64.2 ; also sheet 1,4
D0(1): R70.2 ; also sheet 1,4
GND: C32.1 IC11.7(P:GND) ; also sheet 1,2,3,4,5,6,7,8,10,11,12
N$63: IC11.6(B:O) R60.2 R66.2
N$94: R65.2 T6.3(C)
N$95: R63.2 R65.1 T7.1(G)
N$97: R71.1 T8.1(B)
N$99: R66.1 T6.1(B)
N$100: D22.A R70.1
N$102: D21.A R64.1
N$103: D21.C T7.3(D)
N$125: D22.C T9.3(D)
N$126: R72.2 T8.3(C)
N$127: R69.2 R72.1 T9.1(G)
V+: C32.2 IC11.14(P:VCC) R60.1 R61.1 R123.1 ; also sheet 1,2,3,4,5,6,7,8,10,11,12
W_DATA1_P: IC11.3(A:O) R61.2 R71.2
WD0(0): IC11.5(B:I1) IC15.6(C:O) ; also sheet 8
WD0(1): IC11.1(A:I0) IC15.5(C:I) R123.2 ; also sheet 1,8
WD_ENAB: IC11.2(A:I1) IC11.4(B:I0) ; also sheet 1,10,11

### Notes on the sheet
- P
- R
- N

## Sheet 10 of 13
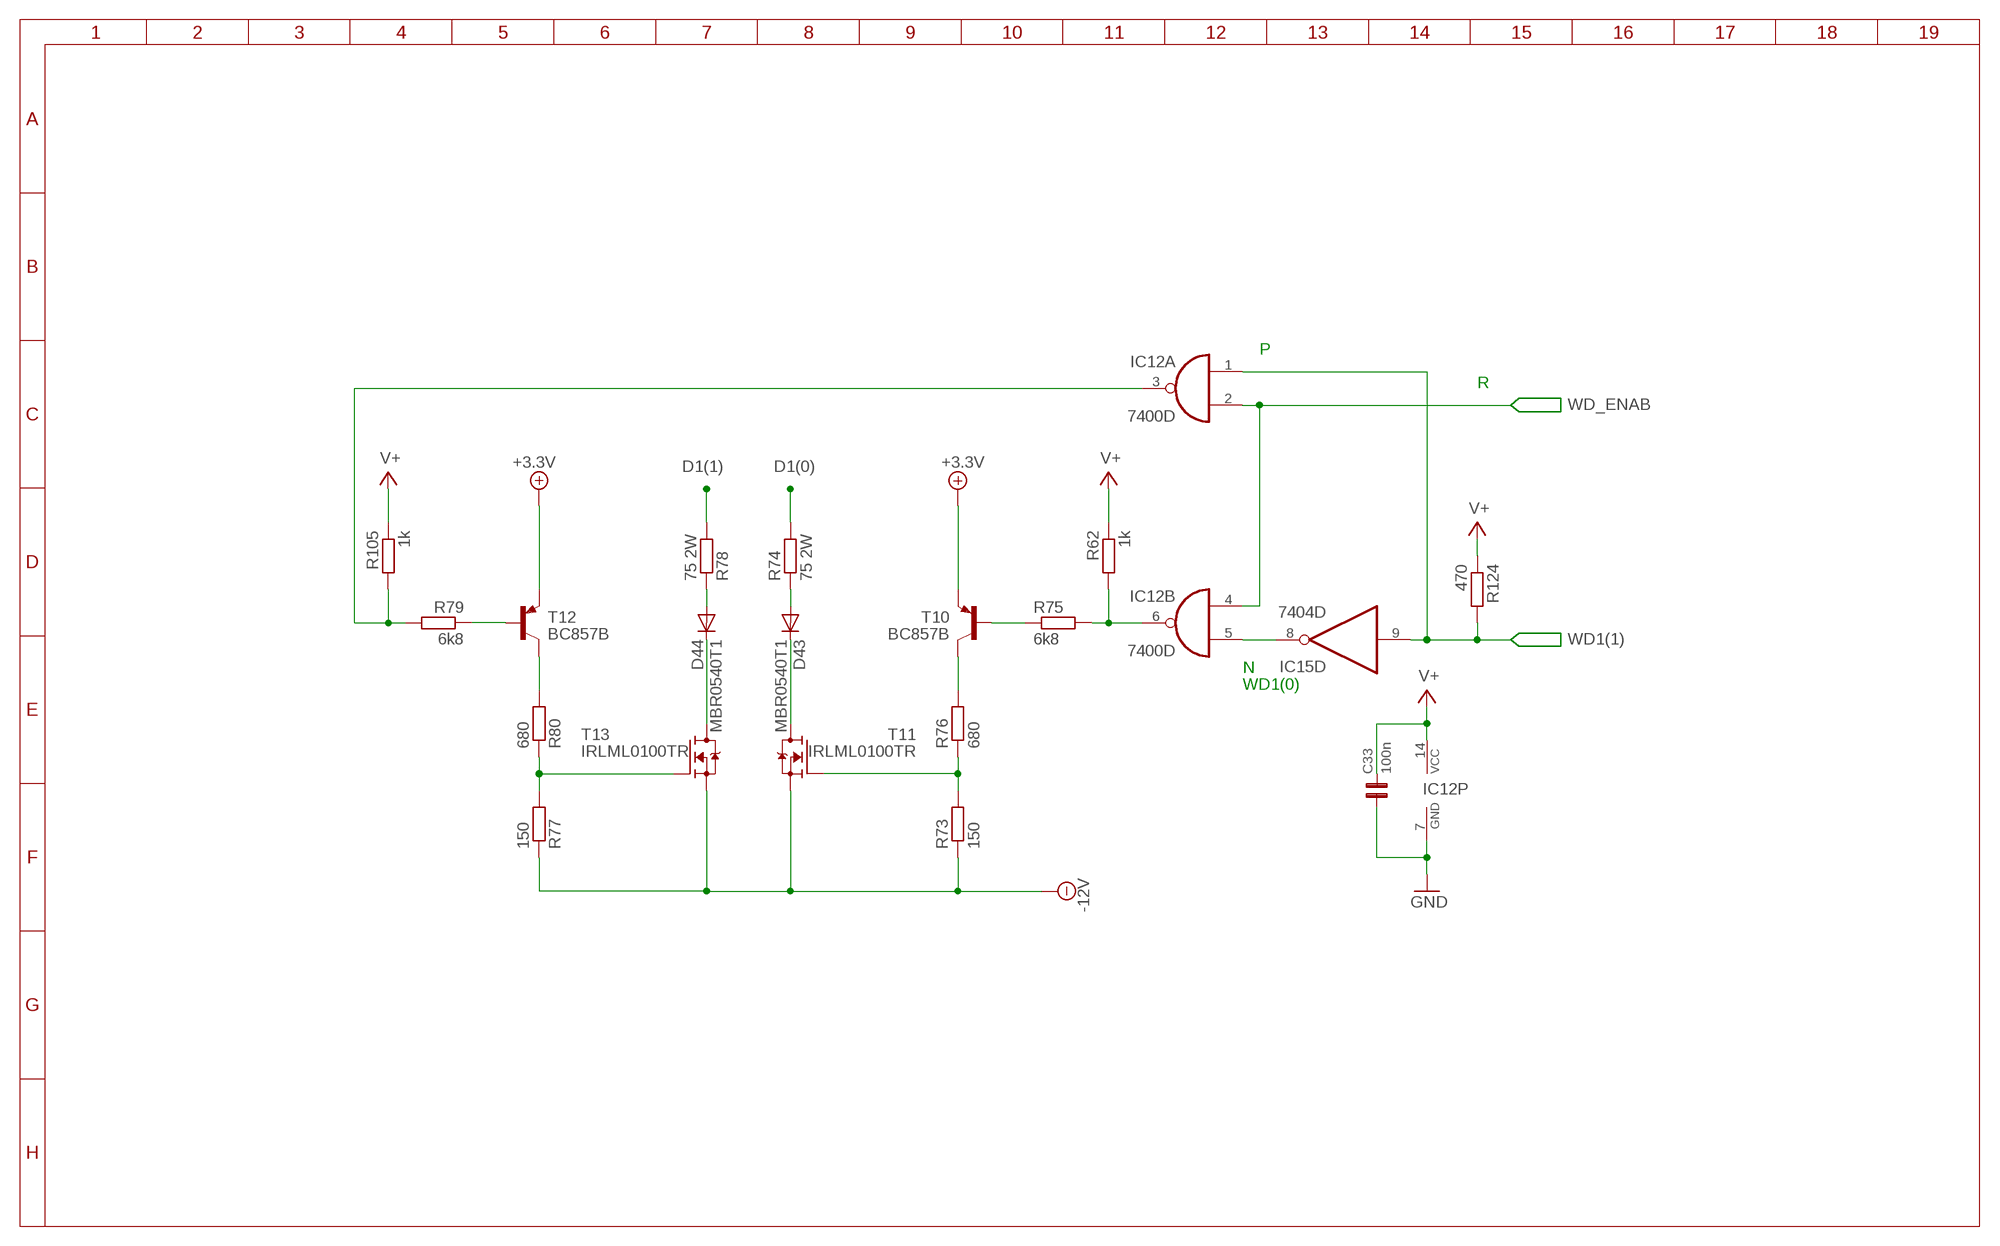
[diagram p9: schematic, sheet 10]

### Parts
C33  100n  C0805  [0805]
D43  MBR0540T1  [SOD123]
D44  MBR0540T1  [SOD123]
R62  1k  R-EU_R0805  [R0805]
R73  150  R-EU_R0805  [R0805]
R74  75 2W  R-EU_R2512  [R2512]
R75  6k8  R-EU_R0805  [R0805]
R76  680  R-EU_R0805  [R0805]
R77  150  R-EU_R0805  [R0805]
R78  75 2W  R-EU_R2512  [R2512]
R79  6k8  R-EU_R0805  [R0805]
R80  680  R-EU_R0805  [R0805]
R105  1k  R-EU_R0805  [R0805]
R124  470  R-EU_R0805  [R0805]
T10  BC857B  [SOT23]
T11  IRLML0100TR  [SOT23]
T12  BC857B  [SOT23]
T13  IRLML0100TR  [SOT23]

### Nets
+3.3V: T10.2(E) T12.2(E) ; also sheet 7,8,9,11,12
-12V: R73.1 R77.1 T11.2(S) T13.2(S) ; also sheet 7,8,9,11,12
D1(0): R74.2 ; also sheet 1,5
D1(1): R78.2 ; also sheet 1,5
GND: C33.1 IC12.7(P:GND) ; also sheet 1,2,3,4,5,6,7,8,9,11,12
N$2: R75.1 T10.1(B)
N$6: D43.A R74.1
N$13: D43.C T11.3(D)
N$15: R76.2 T10.3(C)
N$17: R73.2 R76.1 T11.1(G)
N$18: R79.1 T12.1(B)
N$20: D44.A R78.1
N$21: D44.C T13.3(D)
N$22: R80.2 T12.3(C)
N$23: R77.2 R80.1 T13.1(G)
N$75: IC12.6(B:O) R62.2 R75.2
N$117: IC12.5(B:I1) IC15.8(D:O)
V+: C33.2 IC12.14(P:VCC) R62.1 R105.1 R124.1 ; also sheet 1,2,3,4,5,6,7,8,9,11,12
W_DATA2_P: IC12.3(A:O) R79.2 R105.2
WD1(1): IC12.1(A:I0) IC15.9(D:I) R124.2 ; also sheet 1
WD_ENAB: IC12.2(A:I1) IC12.4(B:I0) ; also sheet 1,9,11

### Notes on the sheet
- P
- R
- N
- WD1(0)

## Sheet 11 of 13
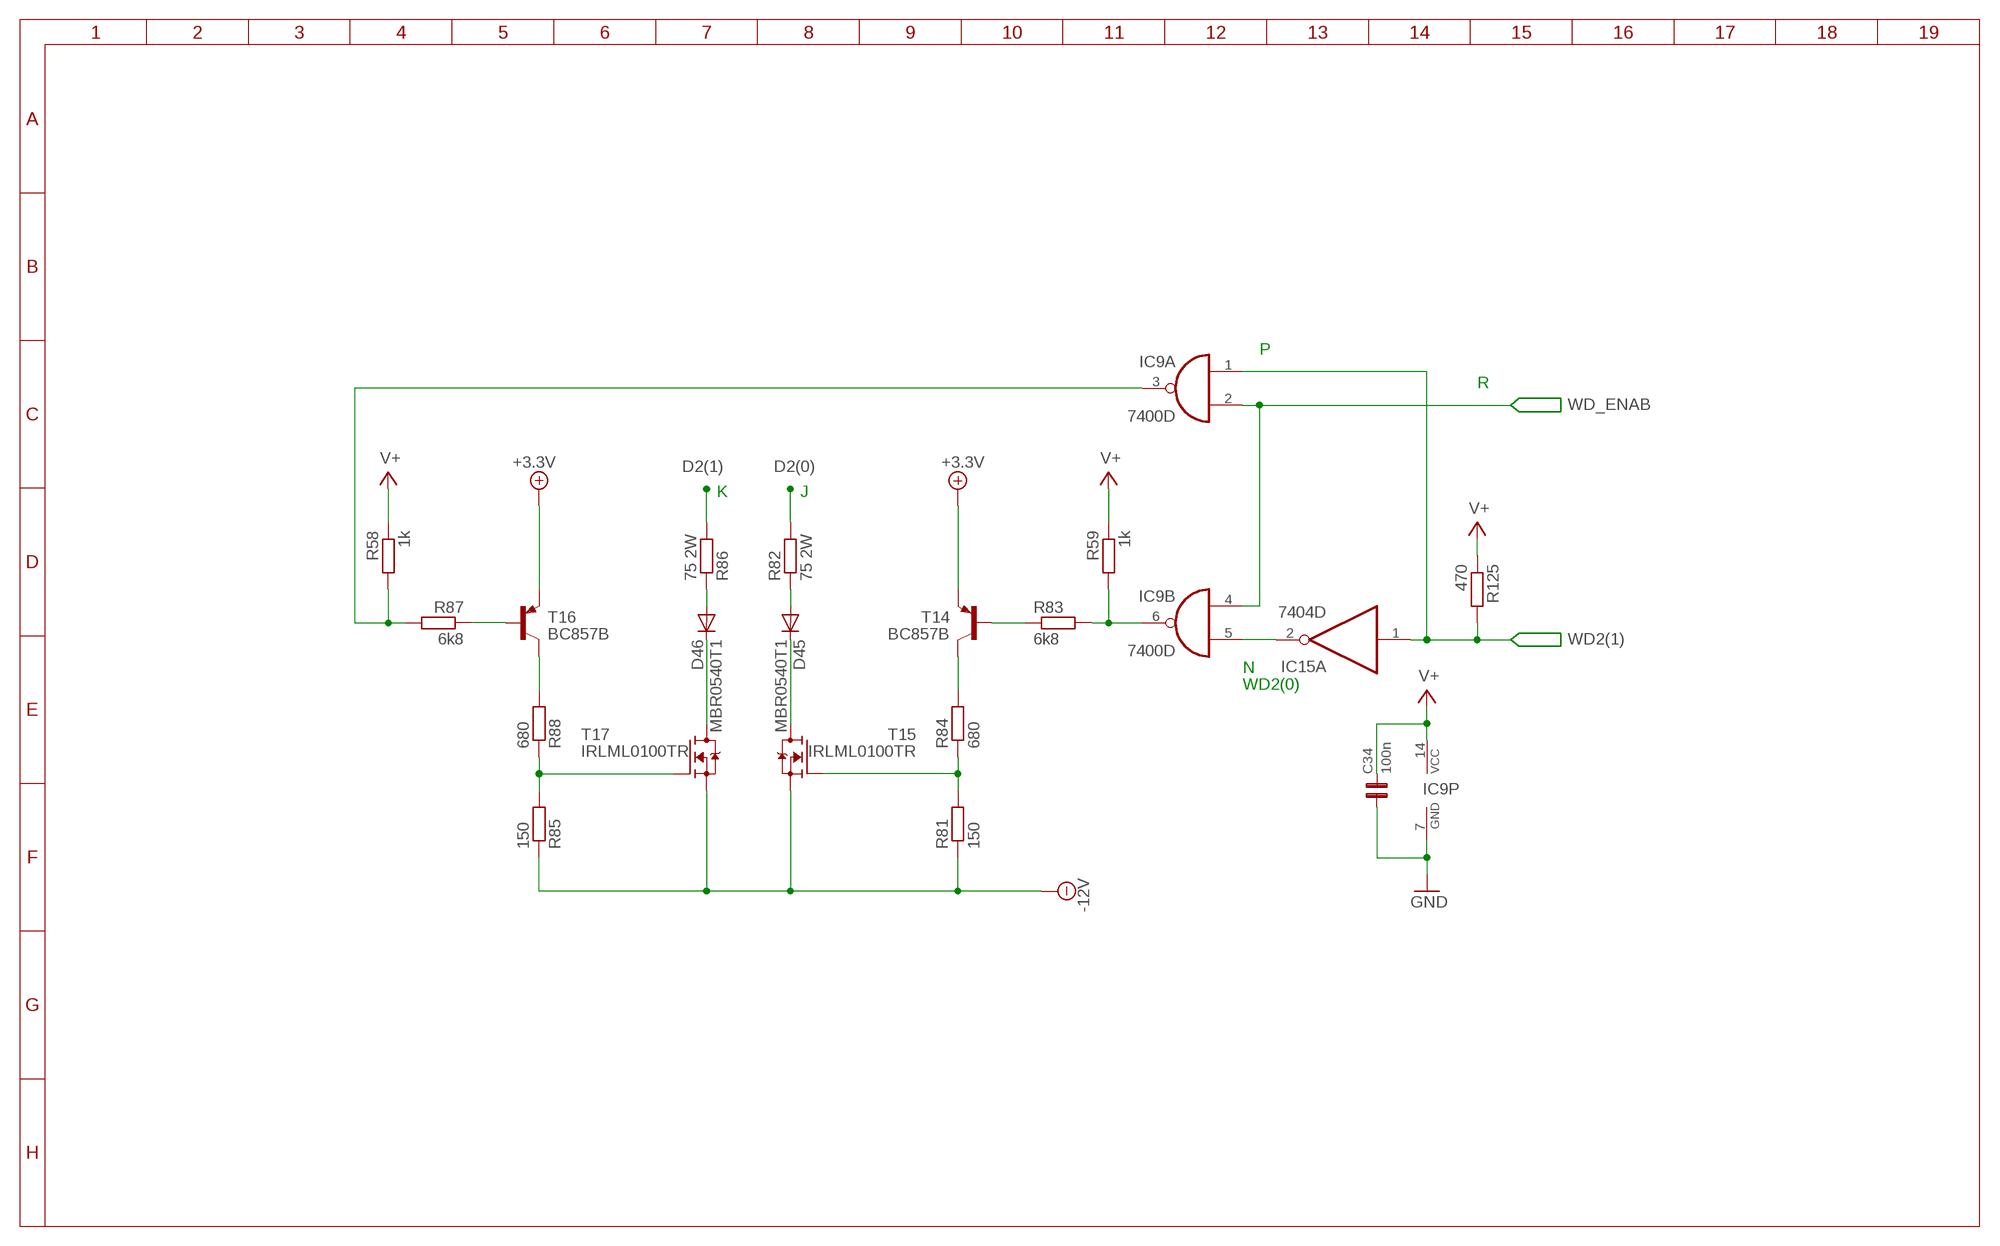
[diagram p10: schematic, sheet 11]

### Parts
C34  100n  C0805  [0805]
D45  MBR0540T1  [SOD123]
D46  MBR0540T1  [SOD123]
R58  1k  R-EU_R0805  [R0805]
R59  1k  R-EU_R0805  [R0805]
R81  150  R-EU_R0805  [R0805]
R82  75 2W  R-EU_R2512  [R2512]
R83  6k8  R-EU_R0805  [R0805]
R84  680  R-EU_R0805  [R0805]
R85  150  R-EU_R0805  [R0805]
R86  75 2W  R-EU_R2512  [R2512]
R87  6k8  R-EU_R0805  [R0805]
R88  680  R-EU_R0805  [R0805]
R125  470  R-EU_R0805  [R0805]
T14  BC857B  [SOT23]
T15  IRLML0100TR  [SOT23]
T16  BC857B  [SOT23]
T17  IRLML0100TR  [SOT23]

### Nets
+3.3V: T14.2(E) T16.2(E) ; also sheet 7,8,9,10,12
-12V: R81.1 R85.1 T15.2(S) T17.2(S) ; also sheet 7,8,9,10,12
D2(0): R82.2 ; also sheet 1,6
D2(1): R86.2 ; also sheet 1,6
GND: C34.1 IC9.7(P:GND) ; also sheet 1,2,3,4,5,6,7,8,9,10,12
N$25: IC9.6(B:O) R59.2 R83.2
N$26: R83.1 T14.1(B)
N$31: D45.A R82.1
N$36: D45.C T15.3(D)
N$39: R84.2 T14.3(C)
N$44: R81.2 R84.1 T15.1(G)
N$52: R87.1 T16.1(B)
N$57: D46.A R86.1
N$65: D46.C T17.3(D)
N$70: R88.2 T16.3(C)
N$101: R85.2 R88.1 T17.1(G)
N$118: IC9.5(B:I1) IC15.2(A:O)
V+: C34.2 IC9.14(P:VCC) R58.1 R59.1 R125.1 ; also sheet 1,2,3,4,5,6,7,8,9,10,12
W_DATA3_P: IC9.3(A:O) R58.2 R87.2
WD2(1): IC9.1(A:I0) IC15.1(A:I) R125.2 ; also sheet 1
WD_ENAB: IC9.2(A:I1) IC9.4(B:I0) ; also sheet 1,9,10

### Notes on the sheet
- P
- R
- K | J
- N
- WD2(0)

## Sheet 12 of 13
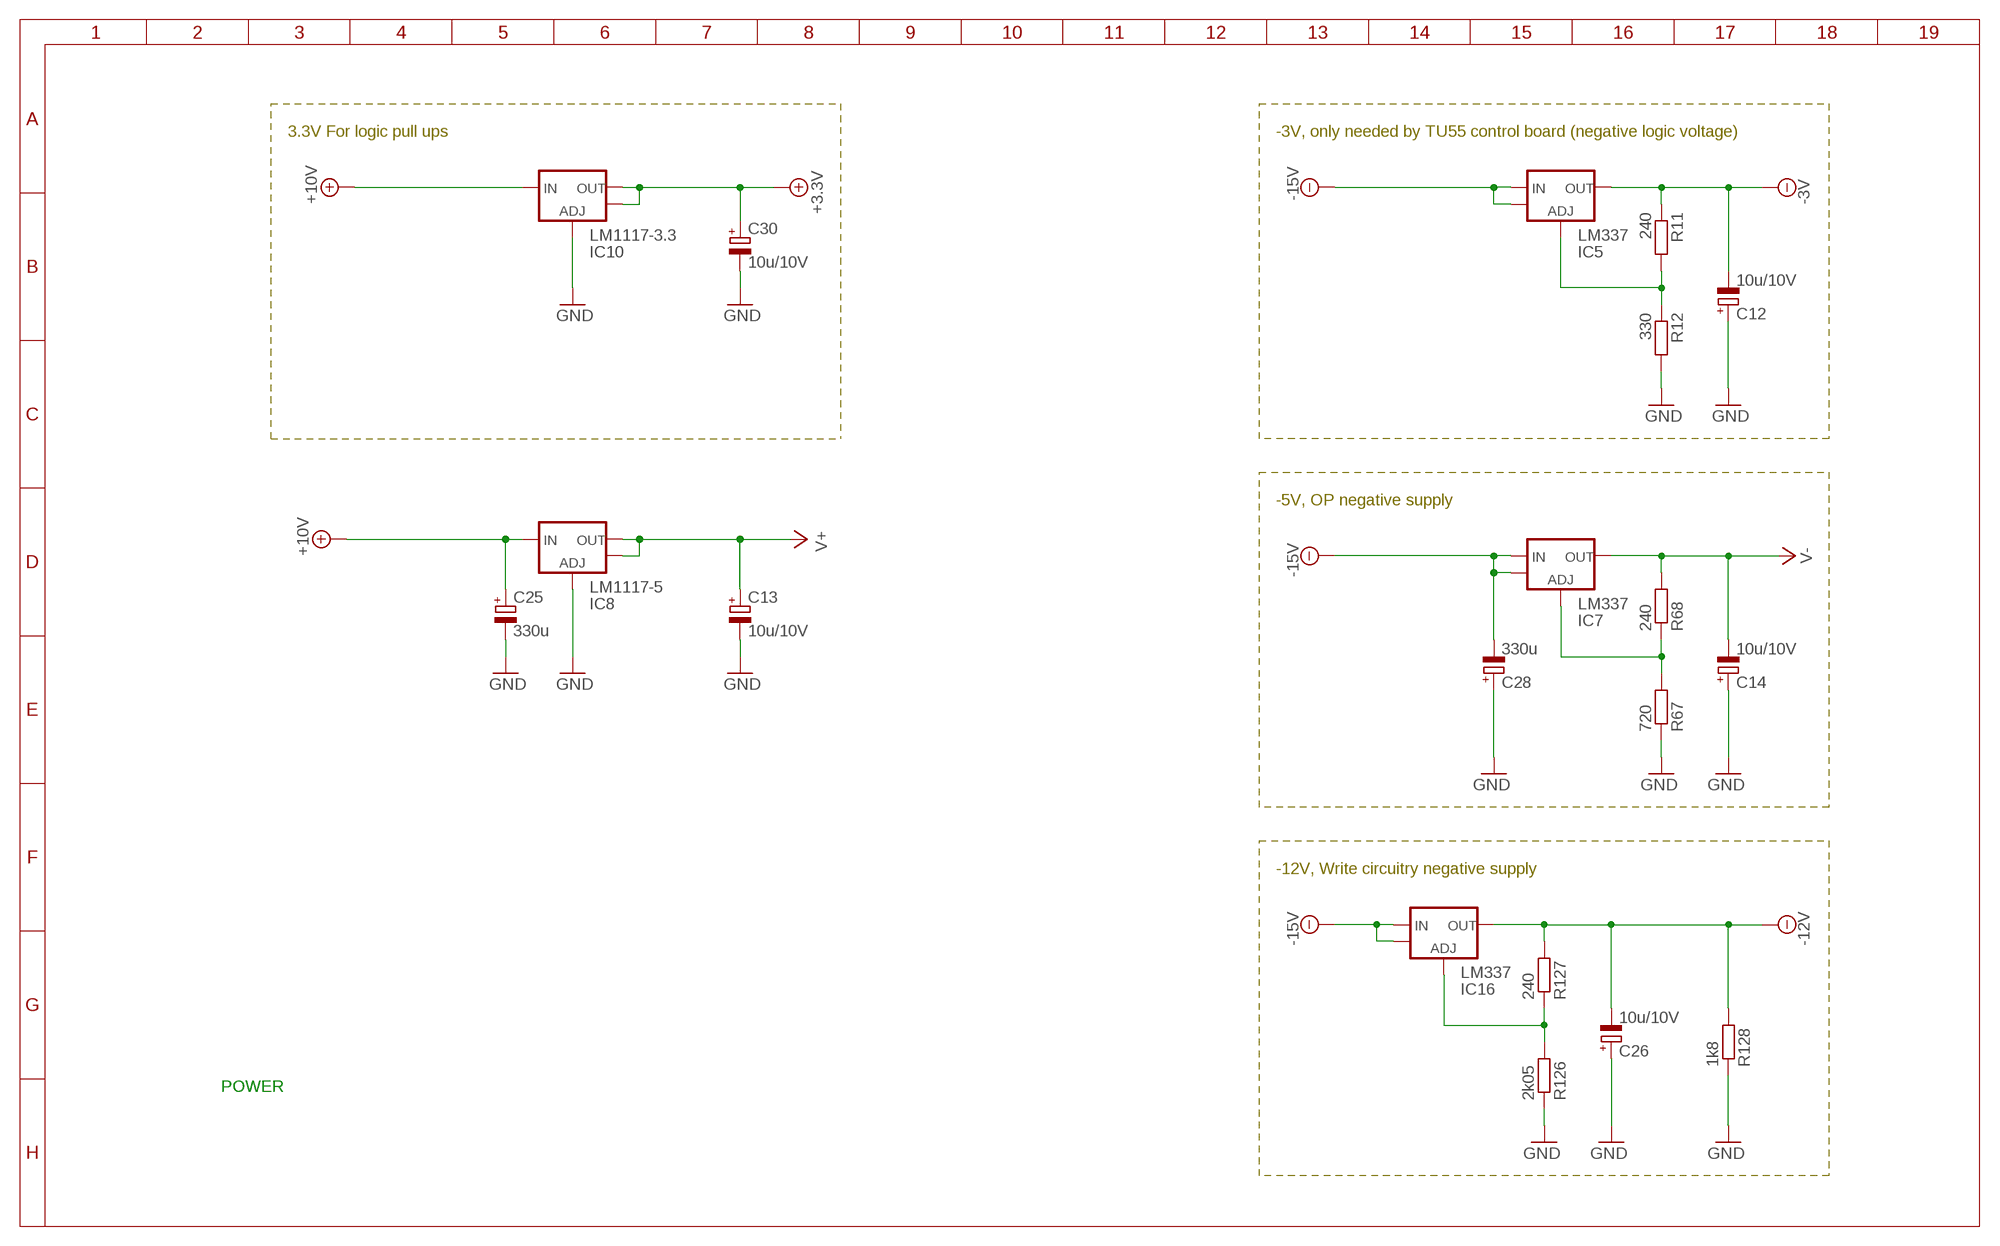
[diagram p11: schematic, sheet 12]

### Parts
C12  10u/10V  CPOL-EUCT3216  [CT3216]
C13  10u/10V  CPOL-EUCT3216  [CT3216]
C14  10u/10V  CPOL-EUCT3216  [CT3216]
C25  330u  CPOL-EUE22-9AXIAL  [E22-9]
C26  10u/10V  CPOL-EUCT3216  [CT3216]
C28  330u  CPOL-EUE22-9AXIAL  [E22-9]
C30  10u/10V  CPOL-EUCT3216  [CT3216]
IC5  LM337  LM337-SOT223  [SOT223]
IC7  LM337  LM337-SOT223  [SOT223]
IC8  LM1117-5  [SOT223]
IC10  LM1117-3.3  [SOT223]
IC16  LM337  LM337-SOT223  [SOT223]
R11  240  R-EU_R0805  [R0805]
R12  330  R-EU_R0805  [R0805]
R67  720  R-EU_R0805  [R0805]
R68  240  R-EU_R0805  [R0805]
R126  2k05  R-EU_R0805  [R0805]
R127  240  R-EU_R0805  [R0805]
R128  1k8  R-EU_R0805  [R0805]

### Nets
+3.3V: C30.+ IC10.2(OUT) IC10.4(OUT_TAB) ; also sheet 7,8,9,10,11
+10V: C25.+ IC8.3(IN) IC10.3(IN) ; also sheet 1
-3V: C12.- IC5.3(OUT) R11.1 ; also sheet 1
-12V: C26.- IC16.3(OUT) R127.2 R128.2 ; also sheet 7,8,9,10,11
-15V: C28.- IC5.2(IN) IC5.4(IN_TAB) IC7.2(IN) IC7.4(IN_TAB) IC16.2(IN) IC16.4(IN_TAB) ; also sheet 1
GND: C12.+ C13.- C14.+ C25.- C26.+ C28.+ C30.- IC8.1(GND) IC10.1(GND) R12.2 R67.1 R126.1 R128.1 ; also sheet 1,2,3,4,5,6,7,8,9,10,11
N$24: IC5.1(ADJ) R11.2 R12.1
N$96: IC7.1(ADJ) R67.2 R68.1
N$119: IC16.1(ADJ) R126.2 R127.1
V+: C13.+ IC8.2(OUT) IC8.4(OUT_TAB) ; also sheet 1,2,3,4,5,6,7,8,9,10,11
V-: C14.- IC7.3(OUT) R68.2 ; also sheet 2,3,4,5,6

### Notes on the sheet
- 3.3V For logic pull ups | -3V, only needed by TU55 control board (negative logic voltage)
- -5V, OP negative supply
- -12V, Write circuitry negative supply
- POWER

## Sheet 13 of 13
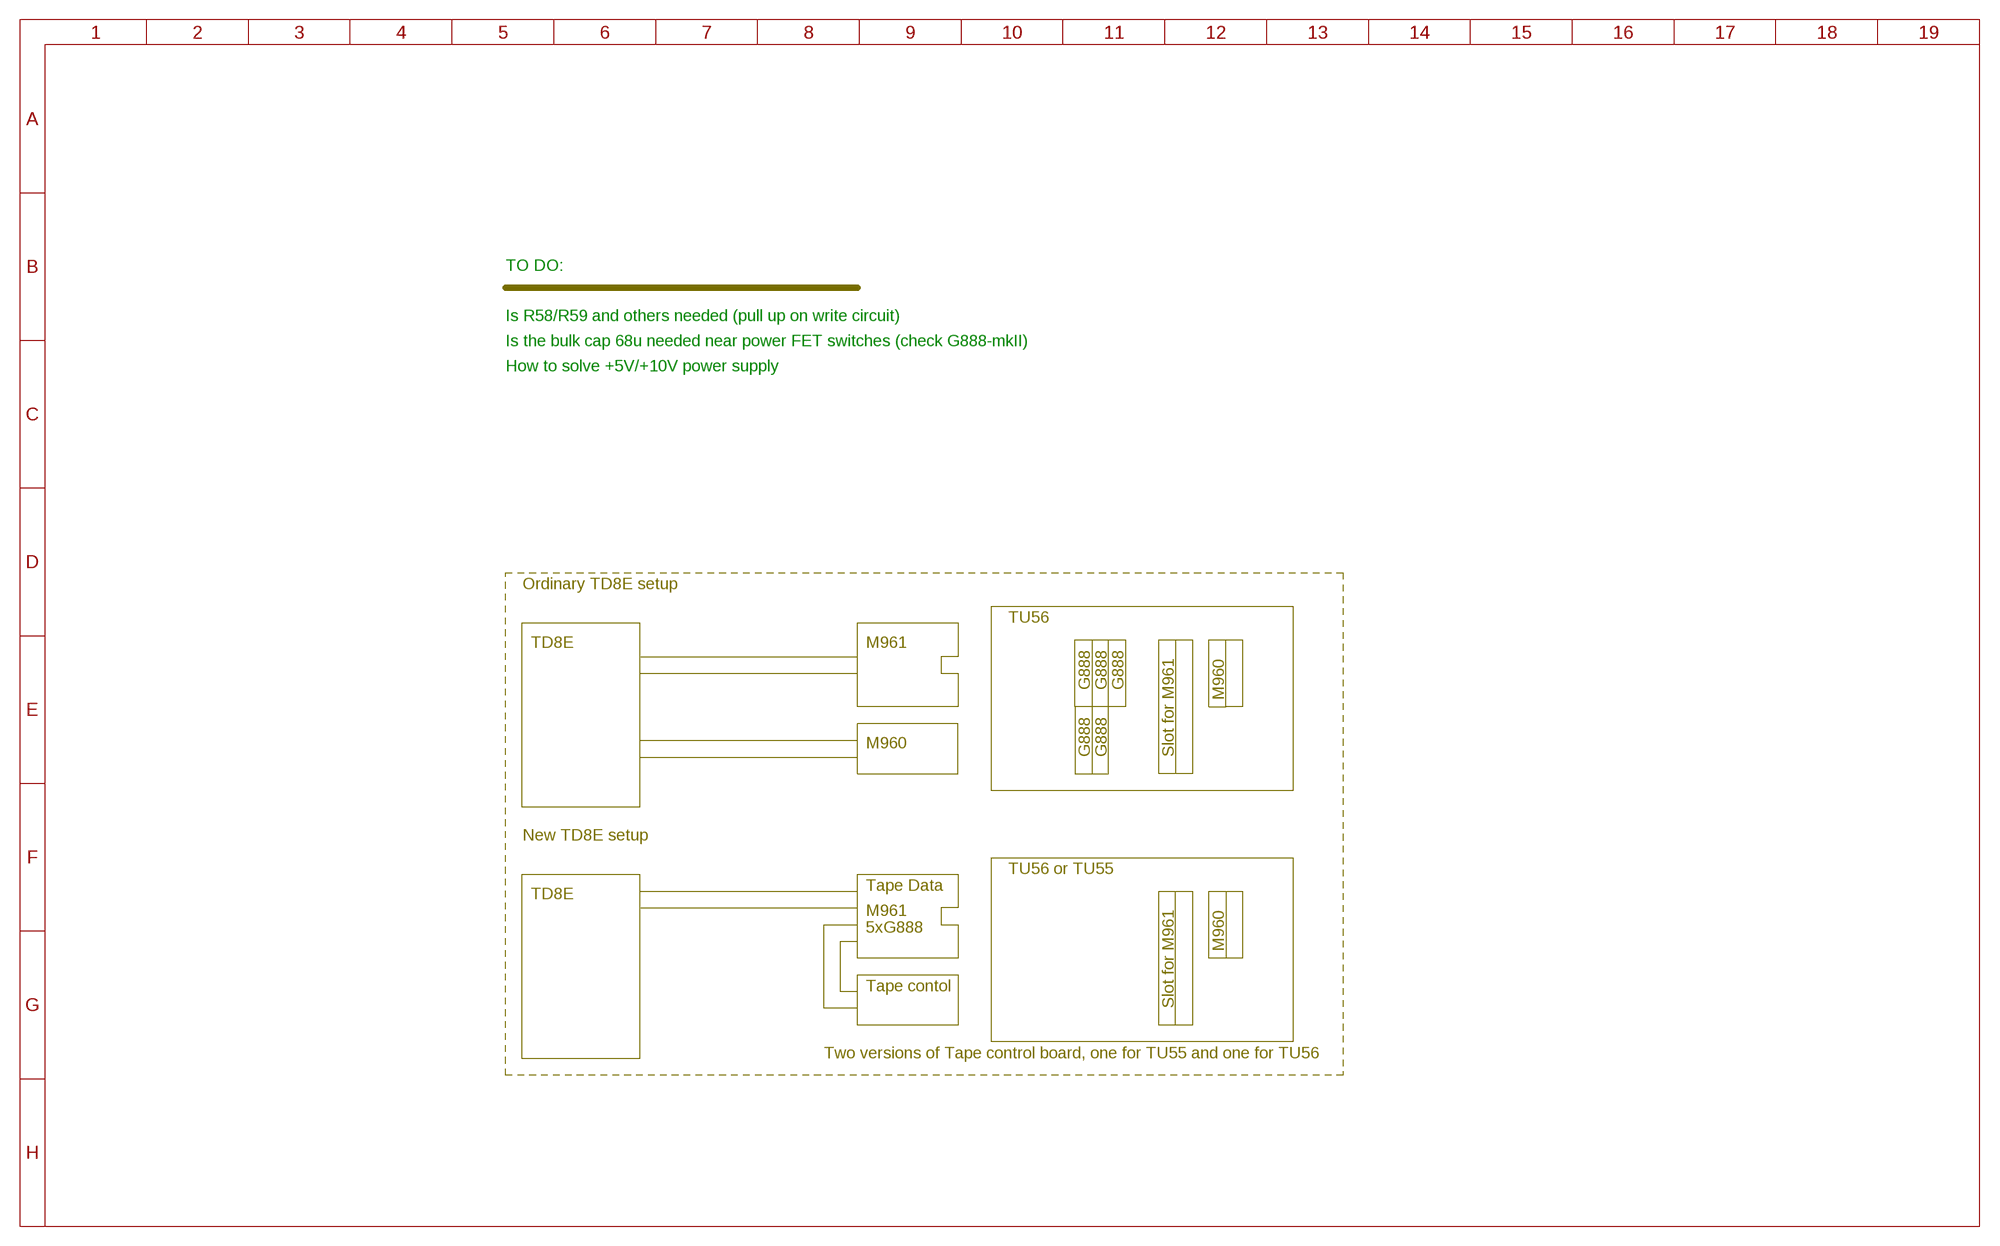
[diagram p12: schematic, sheet 13]

### Notes on the sheet
- TO DO:
- Is R58/R59 and others needed (pull up on write circuit)
- Is the bulk cap 68u needed near power FET switches (check G888-mkII)
- How to solve +5V/+10V power supply
- Ordinary TD8E setup
- TU56
- TD8E | M961
- G888 | G888 | G888
- M960
- M960
- G888 | G888 | Slot for M961
- New TD8E setup
- TU56 or TU55
- Tape Data
- TD8E
- M961
- 5xG888
- M960
- Tape contol
- Slot for M961
- Two versions of Tape control board, one for TU55 and one for TU56

## Library data of the parts
C1-C11 C15-C24 C29 C32-C35 = capsmd:C0805
C12-C14 C25 C26 C28 C30 = anders:CPOL-EU: POLARIZED CAPACITOR, European symbol
D1-D20 D23-D42 D51-D65 = diode:1N4148: DIODE high speed (Philips)
D21 D22 D43-D50 = anders:MBR0540T1: Schottky diod 0,5A Elfa: 70-031-90
IC1-IC4 IC6 = linear:OPA2134: SoundPLUS (TM) High Performance AUDIO OPERATIONAL AMPLIFIERS Source: http://focus.ti.com/lit/ds/sbos058/sbos058.pdf
IC5 IC7 IC16 = v-reg:LM337-SOT223: LM337 surface mount
IC8 IC10 = v-reg:LM1117
IC9 IC11-IC14 = 74xx-eu:74*00: Quad 2-input NAND gate
IC15 = 74xx-eu:74*04: Hex INVERTER
J1 = anders:FLIPCHIP_2-SBS
JP1 = pinhead:PINHD-2X10: PIN HEADER
JP2 = pinhead:PINHD-2X20: PIN HEADER
R1-R26 R28-R109 R111 R112 R114 R115 R117 R118 R120-R128 = anders:R-EU_: RESISTOR, European symbol
R27 R110 R113 R116 R119 = anders:TRIM_EU-: POTENTIOMETER
T1-T5 = transistor:BC847: NPN TRANSISTOR
T6 T8 T10 T12 T14 T16 T18 T20 T22 T24 = anders:BC857B: PNP Transistor
T7 T9 T11 T13 T15 T17 T19 T21 T23 T25 = anders:IRLML0100TR: N-channel MOSFET